# EAGLE design RoboRio Expansion Board V2 (EAGLE 7.5.0)
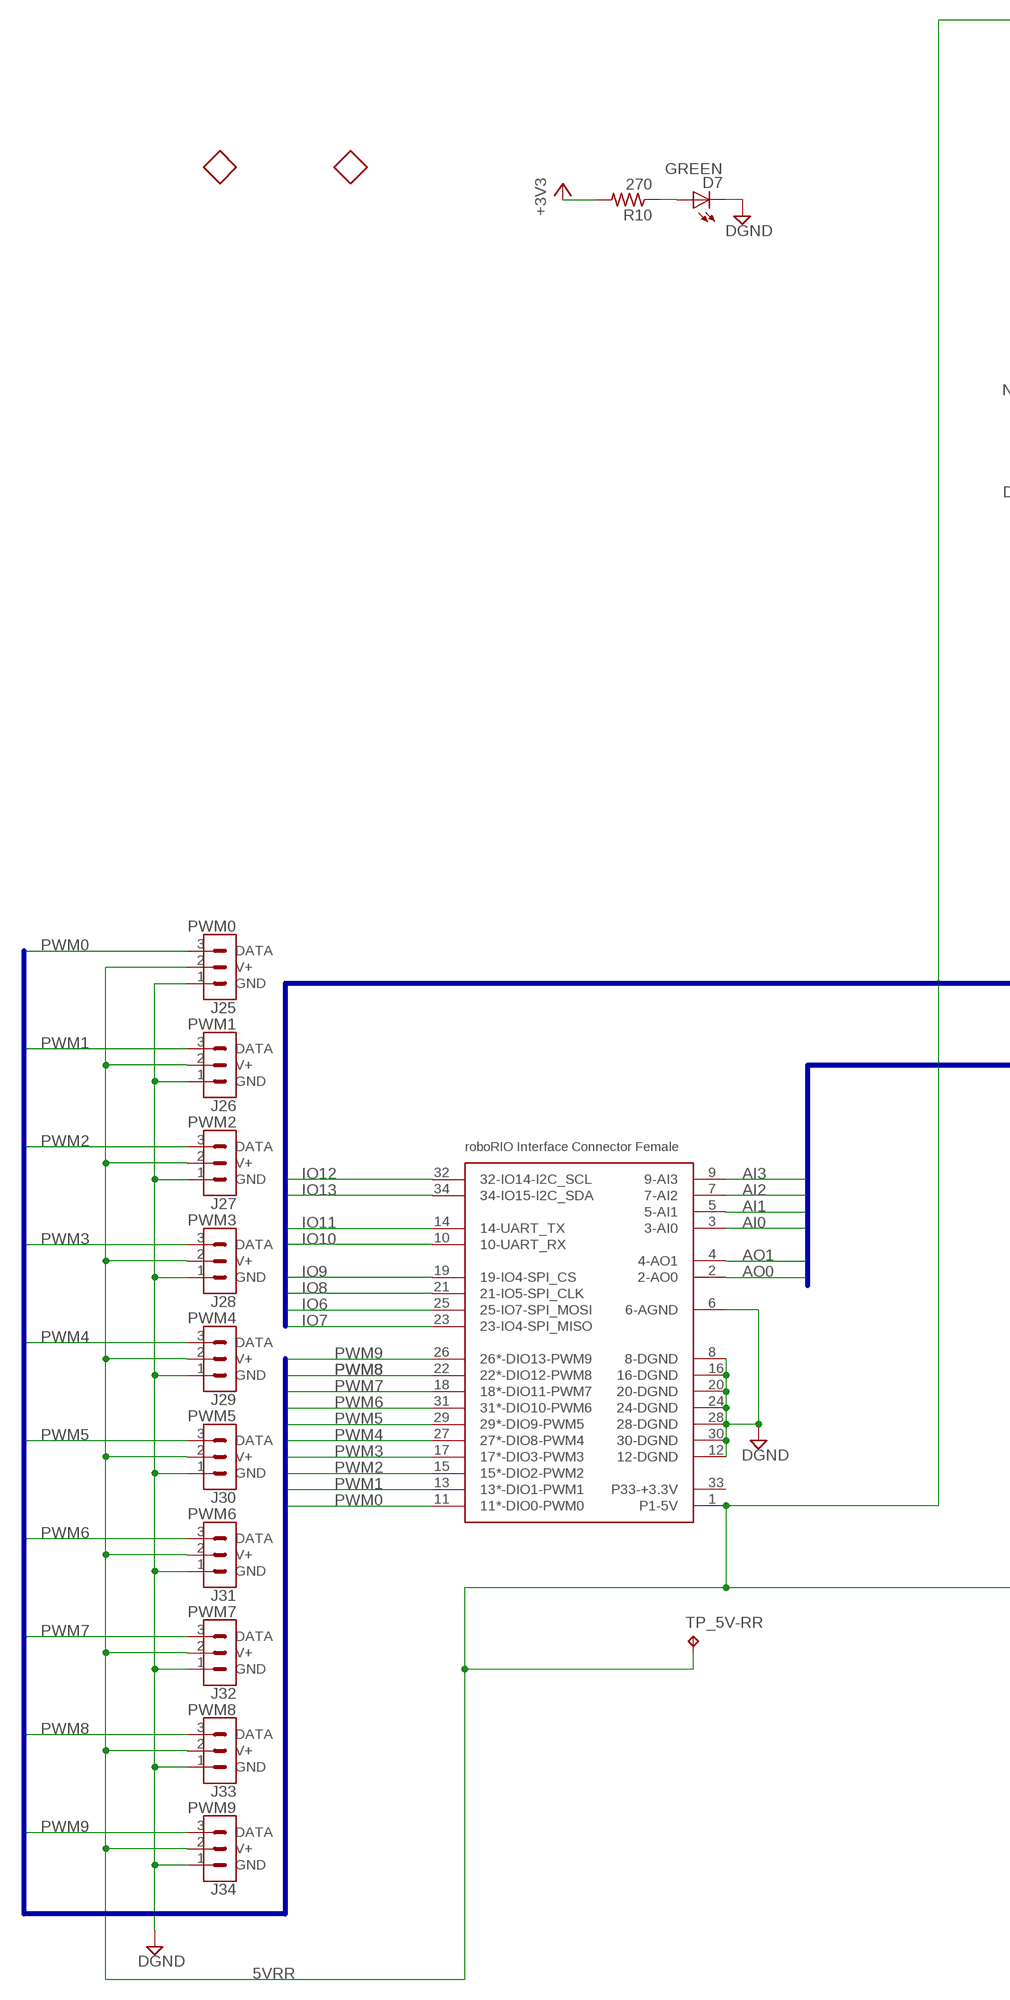
[diagram p0: schematic, sheet 1, part 1 of 3]
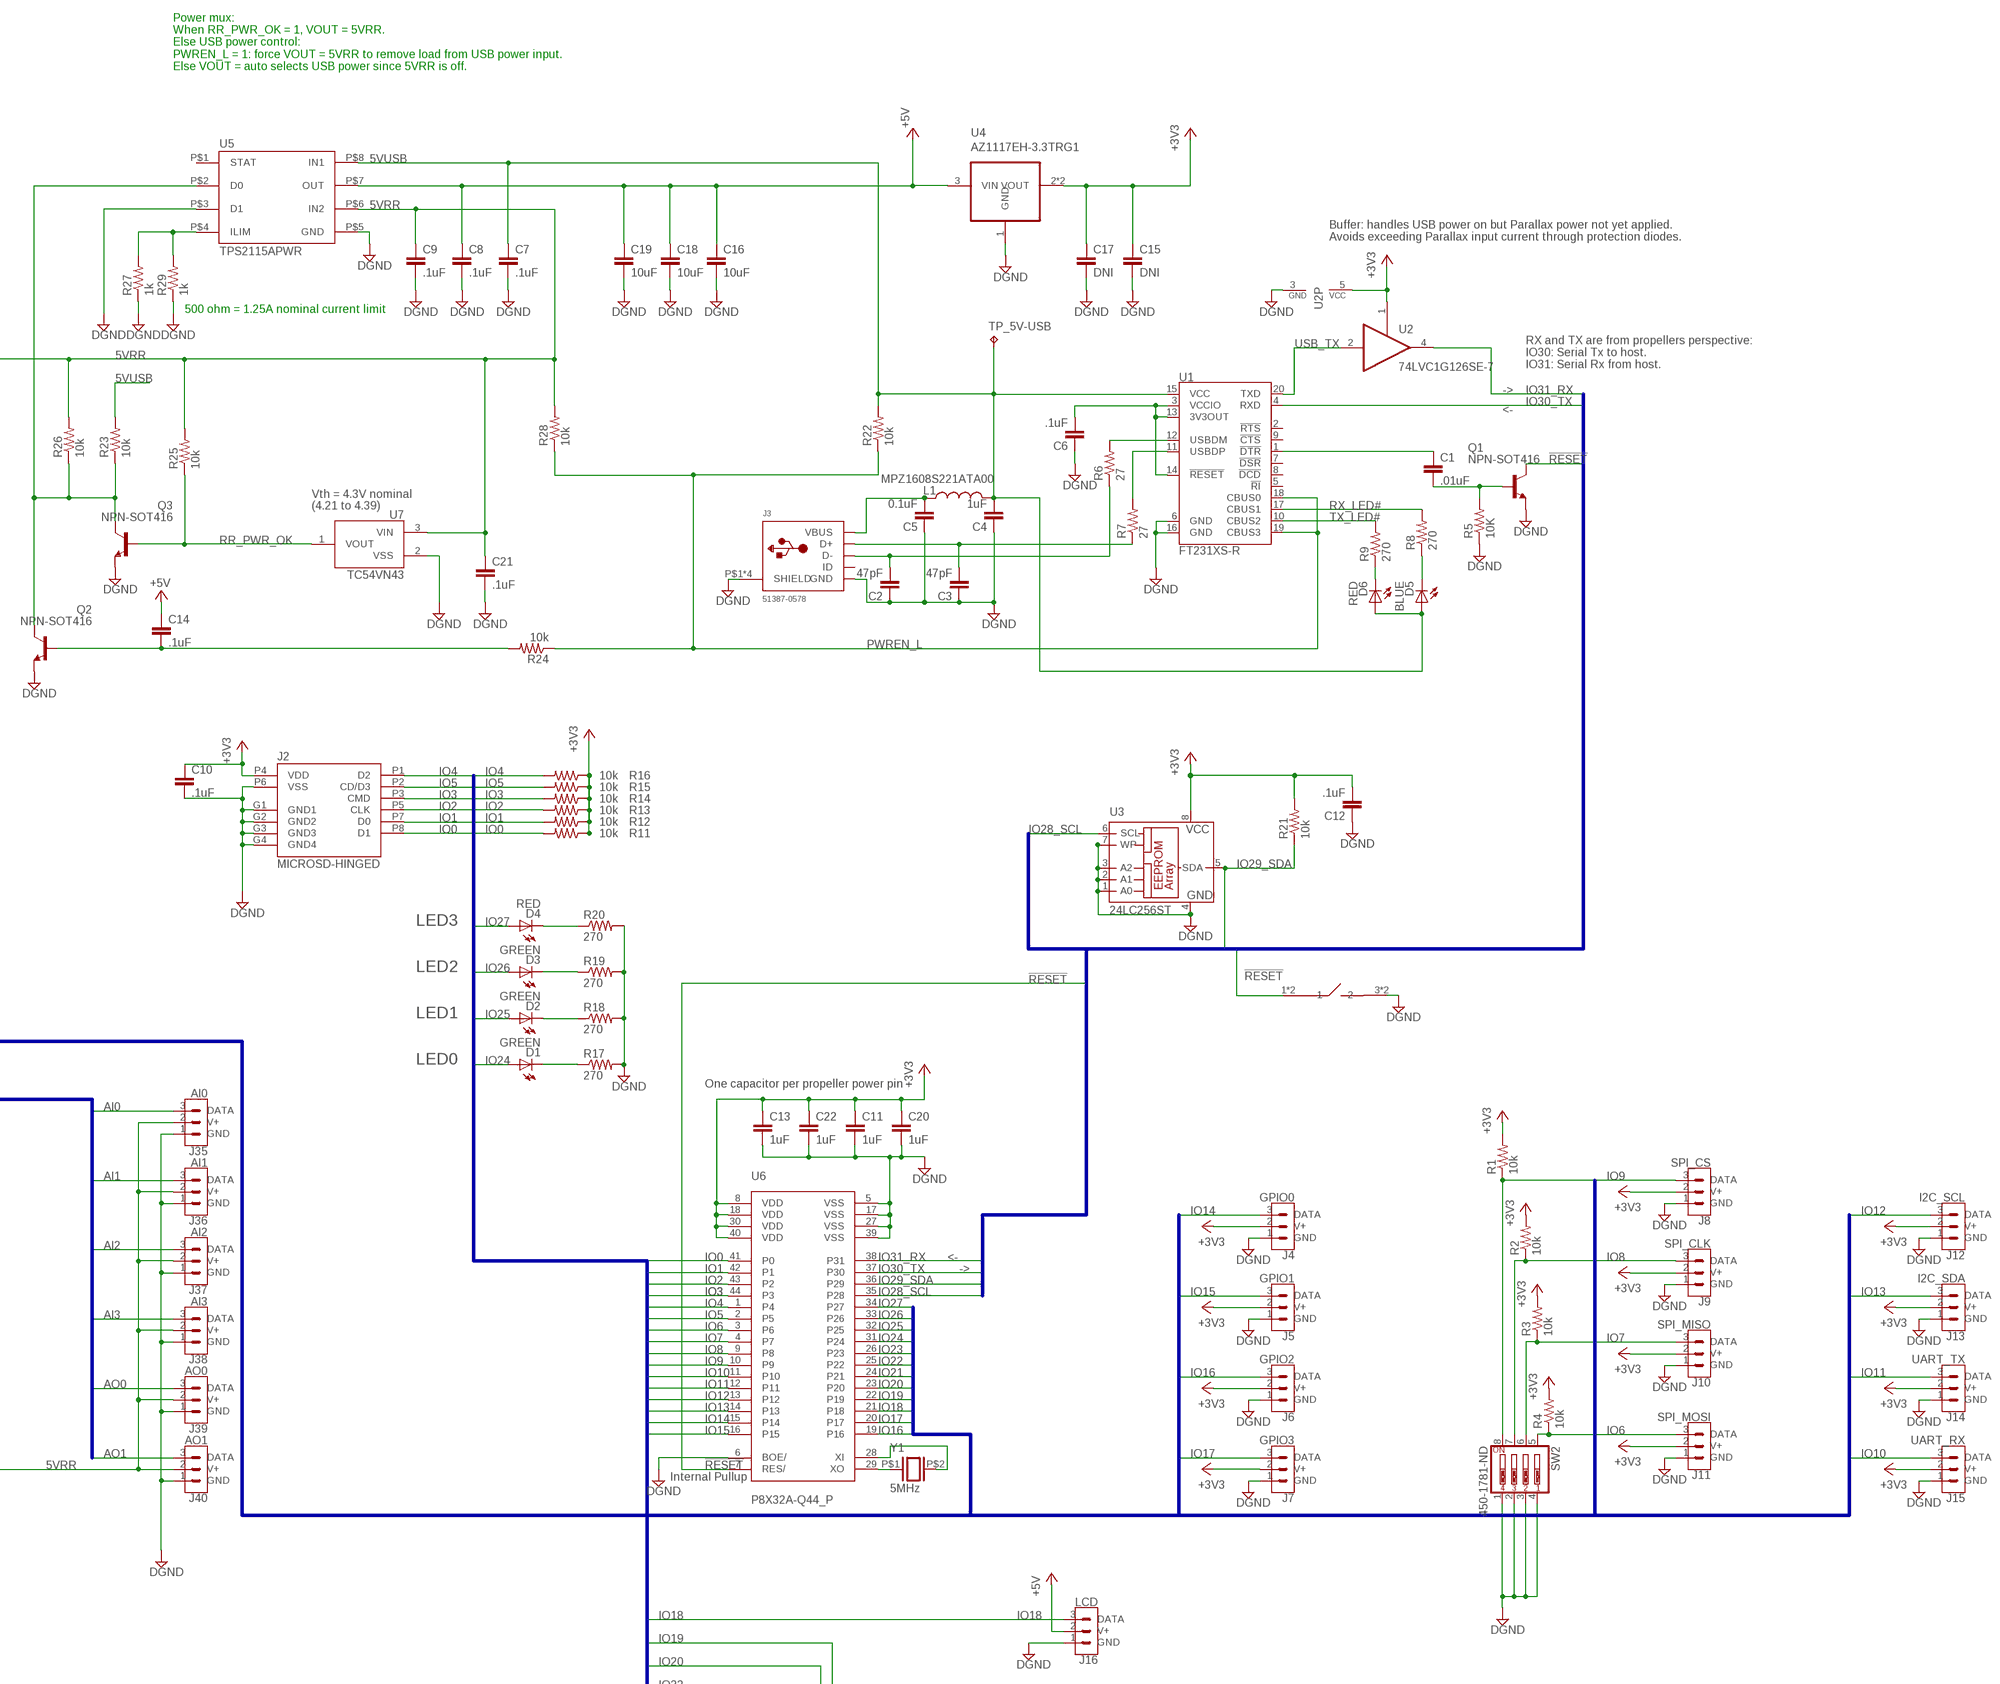
[diagram p1: schematic, sheet 1, part 2 of 3]
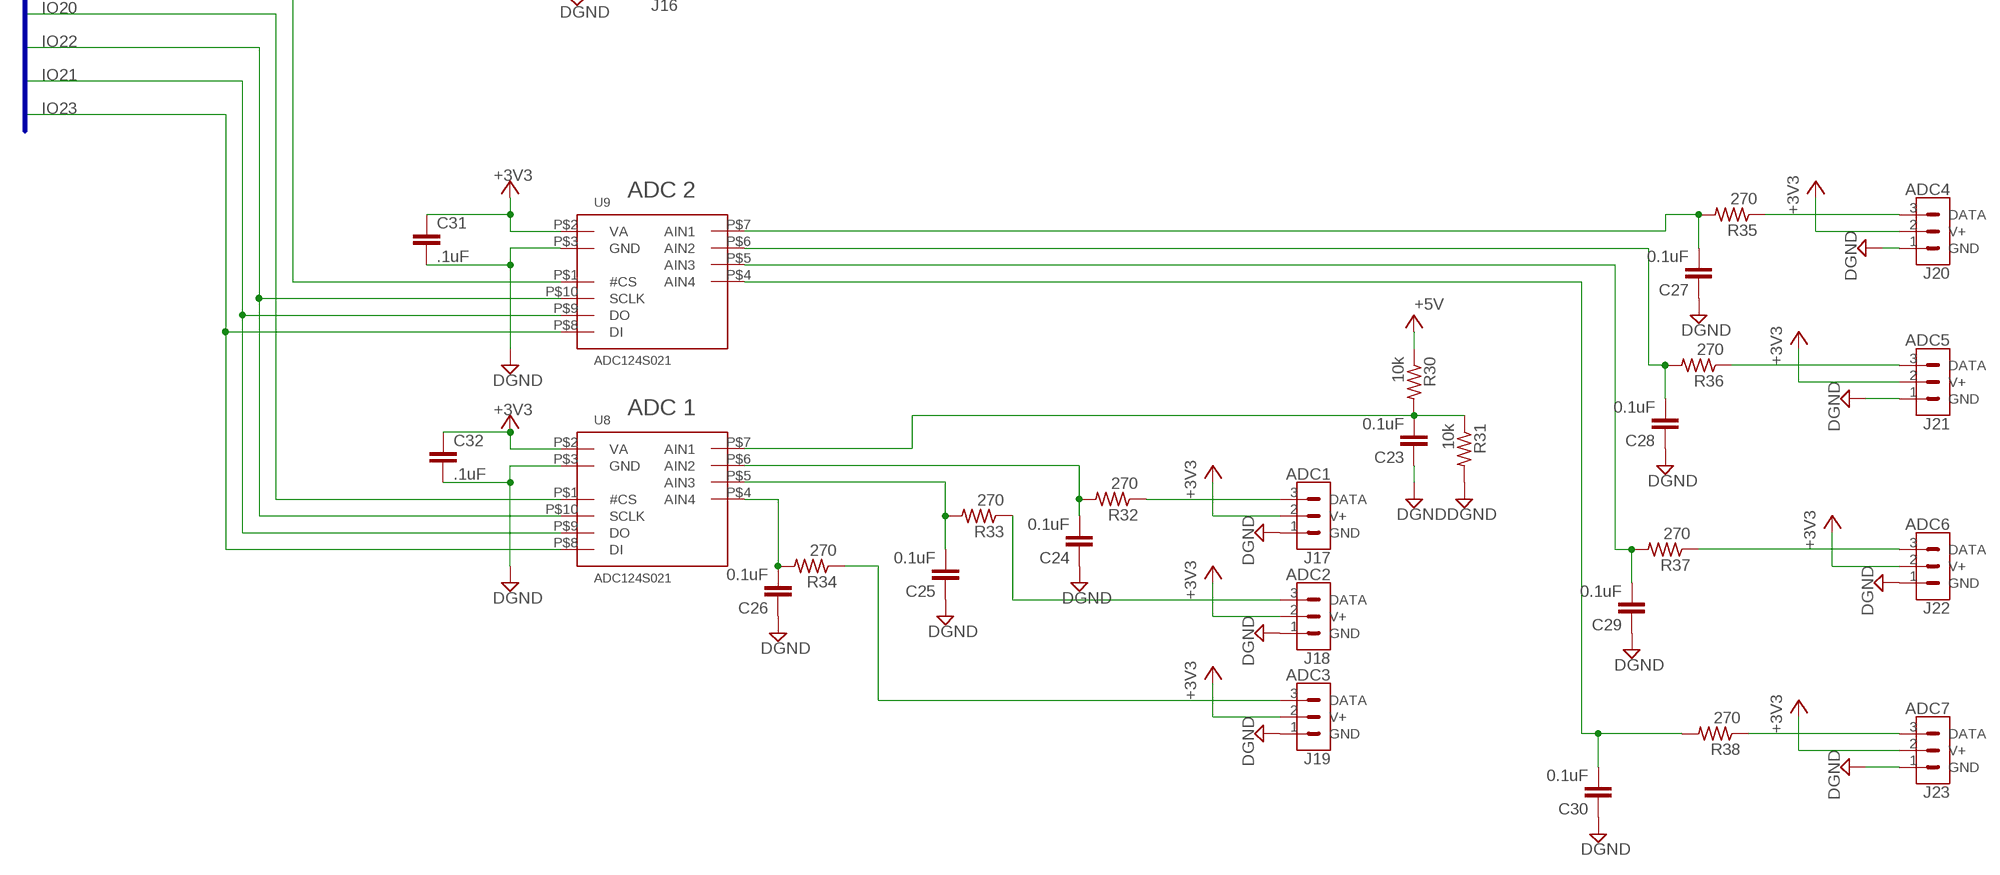
[diagram p2: schematic, sheet 1, part 3 of 3]

## Parts
C1  .01uF  C-EUC0603K  [C0603K]
C2  47pF  C-EUC0603K  [C0603K]
C3  47pF  C-EUC0603K  [C0603K]
C4  1uF  C-EUC0603K  [C0603K]
C5  0.1uF  C-EUC0603K  [C0603K]
C6  .1uF  C-EUC0603K  [C0603K]
C7  .1uF  C-EUC0603K  [C0603K]
C8  .1uF  C-EUC0603K  [C0603K]
C9  .1uF  C-EUC0603K  [C0603K]
C10  .1uF  C-EUC0603K  [C0603K]
C11  1uF  C-EUC0603K  [C0603K]
C12  .1uF  C-EUC0603K  [C0603K]
C13  1uF  C-EUC0603K  [C0603K]
C14  .1uF  C-EUC0603K  [C0603K]
C15  DNI  C-EUC0805K  [C0805K]
C16  10uF  C-EUC0805K  [C0805K]
C17  DNI  C-EUC0805K  [C0805K]
C18  10uF  C-EUC0805K  [C0805K]
C19  10uF  C-EUC0805K  [C0805K]
C20  1uF  C-EUC0603K  [C0603K]
C21  .1uF  C-EUC0603K  [C0603K]
C22  1uF  C-EUC0603K  [C0603K]
C23  0.1uF  C-EUC0603K  [C0603K]
C24  0.1uF  C-EUC0603K  [C0603K]
C25  0.1uF  C-EUC0603K  [C0603K]
C26  0.1uF  C-EUC0603K  [C0603K]
C27  0.1uF  C-EUC0603K  [C0603K]
C28  0.1uF  C-EUC0603K  [C0603K]
C29  0.1uF  C-EUC0603K  [C0603K]
C30  0.1uF  C-EUC0603K  [C0603K]
C31  .1uF  C-EUC0603K  [C0603K]
C32  .1uF  C-EUC0603K  [C0603K]
D1  GREEN  LEDCHIPLED_0603  [CHIPLED_0603]
D2  GREEN  LEDCHIPLED_0603  [CHIPLED_0603]
D3  GREEN  LEDCHIPLED_0603  [CHIPLED_0603]
D4  RED  LEDCHIPLED_0603  [CHIPLED_0603]
D5  BLUE  LEDCHIPLED_0603  [CHIPLED_0603]
D6  RED  LEDCHIPLED_0603  [CHIPLED_0603]
D7  GREEN  LEDCHIPLED_0603  [CHIPLED_0603]
J1  RRINTERFACE-FEMALE  [RRINT-FEMALE]
J2  MICROSD-HINGED  [MICRO_SD_HINGED_TYPE]
J3  51387-0578  USB  [USB-MINIB-0513870578]
J4  GPIO0  3PINDEVICEDEFAULT  [3PINPACKAGE]
J5  GPIO1  3PINDEVICEDEFAULT  [3PINPACKAGE]
J6  GPIO2  3PINDEVICEDEFAULT  [3PINPACKAGE]
J7  GPIO3  3PINDEVICEDEFAULT  [3PINPACKAGE]
J8  SPI_CS  3PINDEVICEDEFAULT  [3PINPACKAGE]
J9  SPI_CLK  3PINDEVICEDEFAULT  [3PINPACKAGE]
J10  SPI_MISO  3PINDEVICEDEFAULT  [3PINPACKAGE]
J11  SPI_MOSI  3PINDEVICEDEFAULT  [3PINPACKAGE]
J12  I2C_SCL  3PINDEVICEDEFAULT  [3PINPACKAGE]
J13  I2C_SDA  3PINDEVICEDEFAULT  [3PINPACKAGE]
J14  UART_TX  3PINDEVICEDEFAULT  [3PINPACKAGE]
J15  UART_RX  3PINDEVICEDEFAULT  [3PINPACKAGE]
J16  LCD  3PINDEVICEDEFAULT  [3PINPACKAGE]
J17  ADC1  3PINDEVICEDEFAULT  [3PINPACKAGE]
J18  ADC2  3PINDEVICEDEFAULT  [3PINPACKAGE]
J19  ADC3  3PINDEVICEDEFAULT  [3PINPACKAGE]
J20  ADC4  3PINDEVICEDEFAULT  [3PINPACKAGE]
J21  ADC5  3PINDEVICEDEFAULT  [3PINPACKAGE]
J22  ADC6  3PINDEVICEDEFAULT  [3PINPACKAGE]
J23  ADC7  3PINDEVICEDEFAULT  [3PINPACKAGE]
J25  PWM0  3PINDEVICEDEFAULT  [3PINPACKAGE]
J26  PWM1  3PINDEVICEDEFAULT  [3PINPACKAGE]
J27  PWM2  3PINDEVICEDEFAULT  [3PINPACKAGE]
J28  PWM3  3PINDEVICEDEFAULT  [3PINPACKAGE]
J29  PWM4  3PINDEVICEDEFAULT  [3PINPACKAGE]
J30  PWM5  3PINDEVICEDEFAULT  [3PINPACKAGE]
J31  PWM6  3PINDEVICEDEFAULT  [3PINPACKAGE]
J32  PWM7  3PINDEVICEDEFAULT  [3PINPACKAGE]
J33  PWM8  3PINDEVICEDEFAULT  [3PINPACKAGE]
J34  PWM9  3PINDEVICEDEFAULT  [3PINPACKAGE]
J35  AI0  3PINDEVICEDEFAULT  [3PINPACKAGE]
J36  AI1  3PINDEVICEDEFAULT  [3PINPACKAGE]
J37  AI2  3PINDEVICEDEFAULT  [3PINPACKAGE]
J38  AI3  3PINDEVICEDEFAULT  [3PINPACKAGE]
J39  AO0  3PINDEVICEDEFAULT  [3PINPACKAGE]
J40  AO1  3PINDEVICEDEFAULT  [3PINPACKAGE]
L1  MPZ1608S221ATA00  INDUCTOR0603  [0603]
Q1  NPN-SOT416  [SC75_INFINEON]
Q2  NPN-SOT416  [SC75_INFINEON]
Q3  NPN-SOT416  [SC75_INFINEON]
R1  10k  R-US_R0603  [R0603]
R2  10k  R-US_R0603  [R0603]
R3  10k  R-US_R0603  [R0603]
R4  10k  R-US_R0603  [R0603]
R5  10K  R-US_R0603  [R0603]
R6  27  R-US_R0603  [R0603]
R7  27  R-US_R0603  [R0603]
R8  270  R-US_R0603  [R0603]
R9  270  R-US_R0603  [R0603]
R10  270  R-US_R0603  [R0603]
R11  10k  R-US_R0603  [R0603]
R12  10k  R-US_R0603  [R0603]
R13  10k  R-US_R0603  [R0603]
R14  10k  R-US_R0603  [R0603]
R15  10k  R-US_R0603  [R0603]
R16  10k  R-US_R0603  [R0603]
R17  270  R-US_R0603  [R0603]
R18  270  R-US_R0603  [R0603]
R19  270  R-US_R0603  [R0603]
R20  270  R-US_R0603  [R0603]
R21  10k  R-US_R0603  [R0603]
R22  10k  R-US_R0603  [R0603]
R23  10k  R-US_R0603  [R0603]
R24  10k  R-US_R0603  [R0603]
R25  10k  R-US_R0603  [R0603]
R26  10k  R-US_R0603  [R0603]
R27  1k  R-US_R0603  [R0603]
R28  10k  R-US_R0603  [R0603]
R29  1k  R-US_R0603  [R0603]
R30  10k  R-US_R0603  [R0603]
R31  10k  R-US_R0603  [R0603]
R32  270  R-US_R0603  [R0603]
R33  270  R-US_R0603  [R0603]
R34  270  R-US_R0603  [R0603]
R35  270  R-US_R0603  [R0603]
R36  270  R-US_R0603  [R0603]
R37  270  R-US_R0603  [R0603]
R38  270  R-US_R0603  [R0603]
SW1  RESETBUTTON9001DEFAULT  [RESETBUTTON9001]
SW2  450-1781-ND  SW_DIP-4  [EDG-04]
TP_5V-RR  TPPAD1-17  [P1-17]
TP_5V-USB  TPPAD1-17  [P1-17]
U1  FT231XS-R  FT231XS  [SSOP20_L]
U2  74LVC1G126SE-7  74LVC1G126DCK  [SC70-5]
U3  24LC256ST  24AA64ST  [TSSOP8]
U4  AZ1117EH-3.3TRG1  REG1117  [SOT223]
U5  TPS2115APWR  [TSSOP-8]
U6  P8X32A-Q44_P  [P8X32A-Q44]
U7  TC54VN43  TC54-CB  [SOT23]
U8  ADC124S021  ADC124S01  [ADC124S021VSSOP]
U9  ADC124S021  ADC124S01  [ADC124S021VSSOP]
U$1  FIDUCIAL_DIAMOND  [FIDUCIAL_40MIL_DIAMOND]
U$2  FIDUCIAL_DIAMOND  [FIDUCIAL_40MIL_DIAMOND]
Y1  5MHz  HC\49USCRYSTAL  [HC\49US]

## Nets
5VRR: C9.1 C21.1 J1.1(P1-5V) J25.2(V+) J26.2(V+) J27.2(V+) J28.2(V+) J29.2(V+) J30.2(V+) J31.2(V+) J32.2(V+) J33.2(V+) J34.2(V+) J35.2(V+) J36.2(V+) J37.2(V+) J38.2(V+) J39.2(V+) J40.2(V+) R25.2 R26.2 R28.2 TP_5V-RR.TP U5.P$6(IN2) U7.3(VIN)
5VUSB: C4.2 C7.1 D5.A D6.A L1.2 R22.2 R23.2 TP_5V-USB.TP U1.15(VCC) U5.P$8(IN1)
!RESET: Q1.3(C) SW1.1 SW1.2 U6.7(RES/)
+3V3: C10.1 C11.1 C12.2 C13.1 C15.1 C17.1 C20.1 C22.1 C31.1 C32.1 J2.P4(VDD) J4.2(V+) J5.2(V+) J6.2(V+) J7.2(V+) J8.2(V+) J9.2(V+) J10.2(V+) J11.2(V+) J12.2(V+) J13.2(V+) J14.2(V+) J15.2(V+) J17.2(V+) J18.2(V+) J19.2(V+) J20.2(V+) J21.2(V+) J22.2(V+) J23.2(V+) R1.2 R2.2 R3.2 R4.2 R10.2 R11.1 R12.1 R13.1 R14.1 R15.1 R16.1 R21.2 U2.1(OE) U2.5(VCC) U3.8(VCC) U4.2(VOUT) U4.4(VOUT) U6.8(VDD) U6.18(VDD) U6.30(VDD) U6.40(VDD) U8.P$2(VA) U9.P$2(VA)
+5V: C8.1 C14.1 C16.1 C18.1 C19.1 J16.2(V+) R30.1 U4.3(VIN) U5.P$7(OUT)
AI0: J1.3(3-AI0) J35.3(DATA)
AI1: J1.5(5-AI1) J36.3(DATA)
AI2: J1.7(7-AI2) J37.3(DATA)
AI3: J1.9(9-AI3) J38.3(DATA)
AO0: J1.2(2-AO0) J39.3(DATA)
AO1: J1.4(4-AO1) J40.3(DATA)
DGND: C2.1 C3.1 C4.1 C5.1 C6.1 C7.2 C8.2 C9.2 C10.2 C11.2 C12.1 C13.2 C15.2 C16.2 C17.2 C18.2 C19.2 C20.2 C21.2 C22.2 C23.1 C24.1 C25.1 C26.1 C27.1 C28.1 C29.1 C30.1 C31.2 C32.2 D7.C J1.6(6-AGND) J1.8(8-DGND) J1.12(12-DGND) J1.16(16-DGND) J1.20(20-DGND) J1.24(24-DGND) J1.28(28-DGND) J1.30(30-DGND) J2.G1(GND1) J2.G2(GND2) J2.G3(GND3) J2.G4(GND4) J2.P6(VSS) J3.GND J3.P$1(SHIELD) J3.P$2(SHIELD) J3.P$3(SHIELD) J3.P$4(SHIELD) J4.1(GND) J5.1(GND) J6.1(GND) J7.1(GND) J8.1(GND) J9.1(GND) J10.1(GND) J11.1(GND) J12.1(GND) J13.1(GND) J14.1(GND) J15.1(GND) J16.1(GND) J17.1(GND) J18.1(GND) J19.1(GND) J20.1(GND) J21.1(GND) J22.1(GND) J23.1(GND) J25.1(GND) J26.1(GND) J27.1(GND) J28.1(GND) J29.1(GND) J30.1(GND) J31.1(GND) J32.1(GND) J33.1(GND) J34.1(GND) J35.1(GND) J36.1(GND) J37.1(GND) J38.1(GND) J39.1(GND) J40.1(GND) Q1.2(E) Q2.2(E) Q3.2(E) R5.1 R17.2 R18.2 R19.2 R20.2 R27.1 R29.1 R31.2 SW1.3 SW1.4 SW2.1 SW2.2 SW2.3 SW2.4 U1.6(GND) U1.16(GND) U2.3(GND) U3.1(A0) U3.2(A1) U3.3(A2) U3.4(GND) U3.7(WP) U4.1(GND) U5.P$3(D1) U5.P$5(GND) U6.5(VSS) U6.6(BOE/) U6.17(VSS) U6.27(VSS) U6.39(VSS) U7.2(VSS) U8.P$3(GND) U9.P$3(GND)
IO0: J2.P8(D1) R11.2 U6.41(P0)
IO1: J2.P7(D0) R12.2 U6.42(P1)
IO2: J2.P5(CLK) R13.2 U6.43(P2)
IO3: J2.P3(CMD) R14.2 U6.44(P3)
IO4: J2.P1(D2) R16.2 U6.1(P4)
IO5: J2.P2(CD/D3) R15.2 U6.2(P5)
IO6: J1.25(25-IO7-SPI_MOSI) J11.3(DATA) R4.1 SW2.5 U6.3(P6)
IO7: J1.23(23-IO4-SPI_MISO) J10.3(DATA) R3.1 SW2.6 U6.4(P7)
IO8: J1.21(21-IO5-SPI_CLK) J9.3(DATA) R2.1 SW2.7 U6.9(P8)
IO9: J1.19(19-IO4-SPI_CS) J8.3(DATA) R1.1 SW2.8 U6.10(P9)
IO10: J1.10(10-UART_RX) J15.3(DATA) U6.11(P10)
IO11: J1.14(14-UART_TX) J14.3(DATA) U6.12(P11)
IO12: J1.32(32-IO14-I2C_SCL) J12.3(DATA) U6.13(P12)
IO13: J1.34(34-IO15-I2C_SDA) J13.3(DATA) U6.14(P13)
IO14: J4.3(DATA) U6.15(P14)
IO15: J5.3(DATA) U6.16(P15)
IO16: J6.3(DATA) U6.19(P16)
IO17: J7.3(DATA) U6.20(P17)
IO18: J16.3(DATA) U6.21(P18)
IO19: U6.22(P19) U9.P$1(#CS)
IO20: U6.23(P20) U8.P$1(#CS)
IO21: U6.24(P21) U8.P$9(DO) U9.P$9(DO)
IO22: U6.25(P22) U8.P$10(SCLK) U9.P$10(SCLK)
IO23: U6.26(P23) U8.P$8(DI) U9.P$8(DI)
IO24: D1.A U6.31(P24)
IO25: D2.A U6.32(P25)
IO26: D3.A U6.33(P26)
IO27: D4.A U6.34(P27)
IO28_SCL: U3.6(SCL) U6.35(P28)
IO29_SDA: R21.1 U3.5(SDA) U6.36(P29)
IO30_TX: U1.4(RXD) U6.37(P30)
IO31_RX: U2.4(O) U6.38(P31)
N$1: C3.2 J3.D+ R7.1
N$2: C2.2 J3.D- R6.1
N$3: C6.2 U1.3(VCCIO) U1.13(3V3OUT) U1.14(!RESET)
N$4: D7.A R10.1
N$5: C14.2 Q2.1(B) R24.2
N$8: J19.3(DATA) R34.1
N$9: J18.3(DATA) R33.1
N$10: C30.2 R38.2 U9.P$4(AIN4)
N$11: R27.2 R29.2 U5.P$4(ILIM)
N$12: D4.C R20.1
N$13: D1.C R17.1
N$14: D2.C R18.1
N$15: C26.2 R34.2 U8.P$4(AIN4)
N$16: C24.2 R32.2 U8.P$6(AIN2)
N$17: D3.C R19.1
N$18: D6.C R9.1
N$19: C1.1 U1.1(!DTR)
N$20: Q2.3(C) Q3.3(C) R23.1 R26.1 U5.P$2(D0)
N$21: C25.2 R33.2 U8.P$5(AIN3)
N$22: J17.3(DATA) R32.1
N$23: D5.C R8.1
N$24: R6.2 U1.12(USBDM)
N$25: C23.2 R30.2 R31.1 U8.P$7(AIN1)
N$26: C1.2 Q1.1(B) R5.2
N$27: R7.2 U1.11(USBDP)
N$28: C5.2 J3.VBUS L1.1
N$30: C29.2 R37.2 U9.P$5(AIN3)
N$32: U6.29(XO) Y1.P$1
N$33: J23.3(DATA) R38.1
N$36: J22.3(DATA) R37.1
N$37: U6.28(XI) Y1.P$2
N$38: C28.2 R36.2 U9.P$6(AIN2)
N$39: J21.3(DATA) R36.1
N$41: C27.2 R35.2 U9.P$7(AIN1)
N$42: J20.3(DATA) R35.1
PWM0: J1.11(11*-DIO0-PWM0) J25.3(DATA)
PWM1: J1.13(13*-DIO1-PWM1) J26.3(DATA)
PWM2: J1.15(15*-DIO2-PWM2) J27.3(DATA)
PWM3: J1.17(17*-DIO3-PWM3) J28.3(DATA)
PWM4: J1.27(27*-DIO8-PWM4) J29.3(DATA)
PWM5: J1.29(29*-DIO9-PWM5) J30.3(DATA)
PWM6: J1.31(31*-DIO10-PWM6) J31.3(DATA)
PWM7: J1.18(18*-DIO11-PWM7) J32.3(DATA)
PWM8: J1.22(22*-DIO12-PWM8) J33.3(DATA)
PWM9: J1.26(26*-DIO13-PWM9) J34.3(DATA)
PWREN_L: R22.1 R24.1 R28.1 U1.18(CBUS0) U1.19(CBUS3)
RR_PWR_OK: Q3.1(B) R25.1 U7.1(VOUT)
RX_LED#: R8.2 U1.17(CBUS1)
TX_LED#: R9.2 U1.10(CBUS2)
USB_TX: U1.20(TXD) U2.2(I)
Unconnected: J1.33(P33-+3.3V) J3.ID U1.2(!RTS) U1.5(!RI) U1.7(!DSR) U1.8(!DCD) U1.9(!CTS) U5.P$1(STAT)

## Buses
IO28_SCL,IO29_SDA,IO30_TX,IO31_RX,!RESET
IO[0..31],UART_TX,UART_RX,I2C_SCL,I2C_SDA
IO[0..31],AI[0..3],AO[0..1],DIO[0..3],DIO[8..13],UART_TX,UART_RX,IO0,I2C_SCL,I2C_SDA
PWM[0..9]

## Notes on the sheet
- Power mux:
  When RR_PWR_OK = 1, VOUT = 5VRR.
  Else USB power control:
  PWREN_L = 1: force VOUT = 5VRR to remove load from USB power input.
  Else VOUT = auto selects USB power since 5VRR is off.
- Buffer: handles USB power on but Parallax power not yet applied.
  Avoids exceeding Parallax input current through protection diodes.
- 500 ohm = 1.25A nominal current limit
- RX and TX are from propellers perspective:
  IO30: Serial Tx to host.
  IO31: Serial Rx from host.
- ->
- <-
- Vth = 4.3V nominal
- (4.21 to 4.39)
- LED3
- LED2
- LED1
- LED0
- One capacitor per propeller power pin
- <-
- ->
- Internal Pullup
- ADC 2
- ADC 1

## Library data of the parts
C1-C32 = resistor:C-EU: CAPACITOR, European symbol
D1-D7 = led:LED: LED OSRAM: - CHIPLED LG R971, LG N971, LY N971, LG Q971, LY Q971, LO R971, LY R971 LH N974, LH R974 LS Q976, LO Q976, LY Q976 LO Q996 - Hyper CHIPLED LW Q18S LB Q993, LB Q99A, LB R99A - SideLED LS A670, LO A670, LY A670, LG A670, LP A670 LB A673, LV A673, LT A673, LW A673 LH A674 LY A675 LS A676, LA A676, LO A676, LY A676, LW A676 LS A679, LY A679, LG A679 - Hyper Micro SIDELED® LS Y876, LA Y876, LO Y876, LY Y876 LT Y87S - SmartLED LW L88C, LW L88S LB L89C, LB L89S, LG L890 LS L89K, LO L89K, LY L89K LS L896, LA L896, LO L896, LY L896 - TOPLED LS T670, LO T670, LY T670, LG T670, LP T670 LSG T670, LSP T670, LSY T670, LOP T670, LYG T670 LG T671, LOG T671, LSG T671 LB T673, LV T673, LT T673, LW T673 LH T674 LS T676, LA T676, LO T676, LY T676, LB T676, LH T676, LSB T676, LW T676 LB T67C, LV T67C, LT T67C, LS T67K, LO T67K, LY T67K, LW E67C LS E67B, LA E67B, LO E67B, LY E67B, LB E67C, LV E67C, LT E67C LW T67C LS T679, LY T679, LG T679 LS T770, LO T770, LY T770, LG T770, LP T770 LB T773, LV T773, LT T773, LW T773 LH T774 LS E675, LA E675, LY E675, LS T675 LS T776, LA T776, LO T776, LY T776, LB T776 LHGB T686 LT T68C, LB T68C - Hyper Mini TOPLED® LB M676 - Mini TOPLED Santana® LG M470 LS M47K, LO M47K, LY M47K Source: http://www.osram.convergy.de LUXEON: - LUMILED® LXK2-PW12-R00, LXK2-PW12-S00, LXK2-PW14-U00, LXK2-PW14-V00 LXK2-PM12-R00, LXK2-PM12-S00, LXK2-PM14-U00 LXK2-PE12-Q00, LXK2-PE12-R00, LXK2-PE12-S00, LXK2-PE14-T00, LXK2-PE14-U00 LXK2-PB12-K00, LXK2-PB12-L00, LXK2-PB12-M00, LXK2-PB14-N00, LXK2-PB14-P00, LXK2-PB14-Q00 LXK2-PR12-L00, LXK2-PR12-M00, LXK2-PR14-Q00, LXK2-PR14-R00 LXK2-PD12-Q00, LXK2-PD12-R00, LXK2-PD12-S00 LXK2-PH12-R00, LXK2-PH12-S00 LXK2-PL12-P00, LXK2-PL12-Q00, LXK2-PL12-R00 Source: www.luxeon.com KINGBRIGHT: KA-3528ASYC Source: www.kingbright.com
J1 = RoboRioConnector:RRINTERFACE-FEMALE
J2 = MicroSdSocket:MICROSD-HINGED
J3 = adafruit:USB: USB Connectors USBMINIB - Surface Mount Female Mini-B USB Connector 4UConnector: 06564 By microbuilder.eu Thru-hole RA Female Mini-B USB Connector 4UConnector: 18732 By ladyada.net
J4-J23 J25-J40 = 3pin:3PINDEVICE
L1 = SparkFun-Passives:INDUCTOR: Inductors Basic Inductor/Choke - 0603 and 1206. Footprints are not proven and vary greatly between part numbers. INDUCTOR POWER 3.3UH 4.0A SMD 0.197" L x 0.197" W x 0.177" H (5.00mm x 5.00mm x 4.50mm)
Q1-Q3 = NPN transistor:NPN-SOT416
R1-R38 = resistor:R-US_: RESISTOR, American symbol
SW1 = resetbutton9001:RESETBUTTON9001
SW2 = crystalsmt:SW_DIP-4: DIP SWITCH
TP_5V-RR TP_5V-USB = testpad:TP: Test pad
U1 = SparkFun-DigitalIC:FT231X: FTDI FT231X Full Speed USB to Full-handshake UART This USB2.0 Full Speed IC offers a compact bridge to full handshake UART interfaces. The device is a UART, capable of operating up to 3MBaud, with low power consumption (8mA). The FT231X includes the complete FT-X series feature set and enables USB to be added into a system design quickly and easily over a UART interface.; PROD_ID: IC-11524; VALUE: FTS31XS-U
U2 = 74xx-little-us:74*1G126: Single Bus Buffer Gate With 3-State Outputs
U3 = microchip:24*: Serial EEPROM I2C; MPN: 25AA640A-I/ST; OC_FARNELL: 1818513; OC_NEWARK: 27M1300
U4 = burr-brown:REG1117: 800mA and 1A Low Dropout (LDO) Positive Regulator 1.8V, 2.5V, 2.85V, 3.3V, 5V, and Adj; MPN: AZ1117EH-3.3TRG1; OC_FARNELL: 1097566; OC_NEWARK: 14P6981
U5 = tps2115apwr:TPS2115APWR
U6 = parallax_propeller:P8X32A-Q44_P
U7 = m-pad-2.1:TC54: Microchip TC54 Voltage Detector Description: The TC54 series are CMOS voltage detectors that are especially well suited for battery-powered applications because of their extremely low 1 uA operating current and small surface-mount packaging. Each part is lasertrimmed to the desired threshold voltage, which can be specified from 1.4V to 7.7V for a 2% tolerance and from 1.5V to 6.0V for a 1% tolerance. The device includes a comparator, low-current highprecision reference, laser-trimmed divider, hysteresis circuit and output driver. The TC54 is available with either an open-drain or complementary output stage. During operation, the TC54's output (VOUT) remains in the logic-high state as long as VIN is greater than the specified threshold voltage (VDET -). When VIN falls below VDET -, the output is driven to a logic-low. VOUT remains low until VIN rises above VDET - by an amount VHYST, whereupon it resets to a logic-high. Features: Precise Detection Thresholds: Standard ±2.0%, Custom ±1.0% Small Packages: 3-Pin SOT-23A, 3-Pin SOT-89, TO-92 and 5-Pin SOT-23A (7.7V only) Low Current Drain: Typ. 1 uA Wide Detection Range: 1.1V to 6.0V and 7.7V Wide Operating Voltage Range: 0.7V to 10V Applications: Battery Voltage Monitoring Microprocessor Reset System Brown-Out Protection Switching Circuit in Battery Backup Level Discriminator Please send any comments to: messi@users.sourceforge.net
U8 U9 = adc124s021cimm:ADC124S01
U$1 U$2 = fiducial:FIDUCIAL_DIAMOND
Y1 = crystalsmt:HC\49USCRYSTAL

## Board
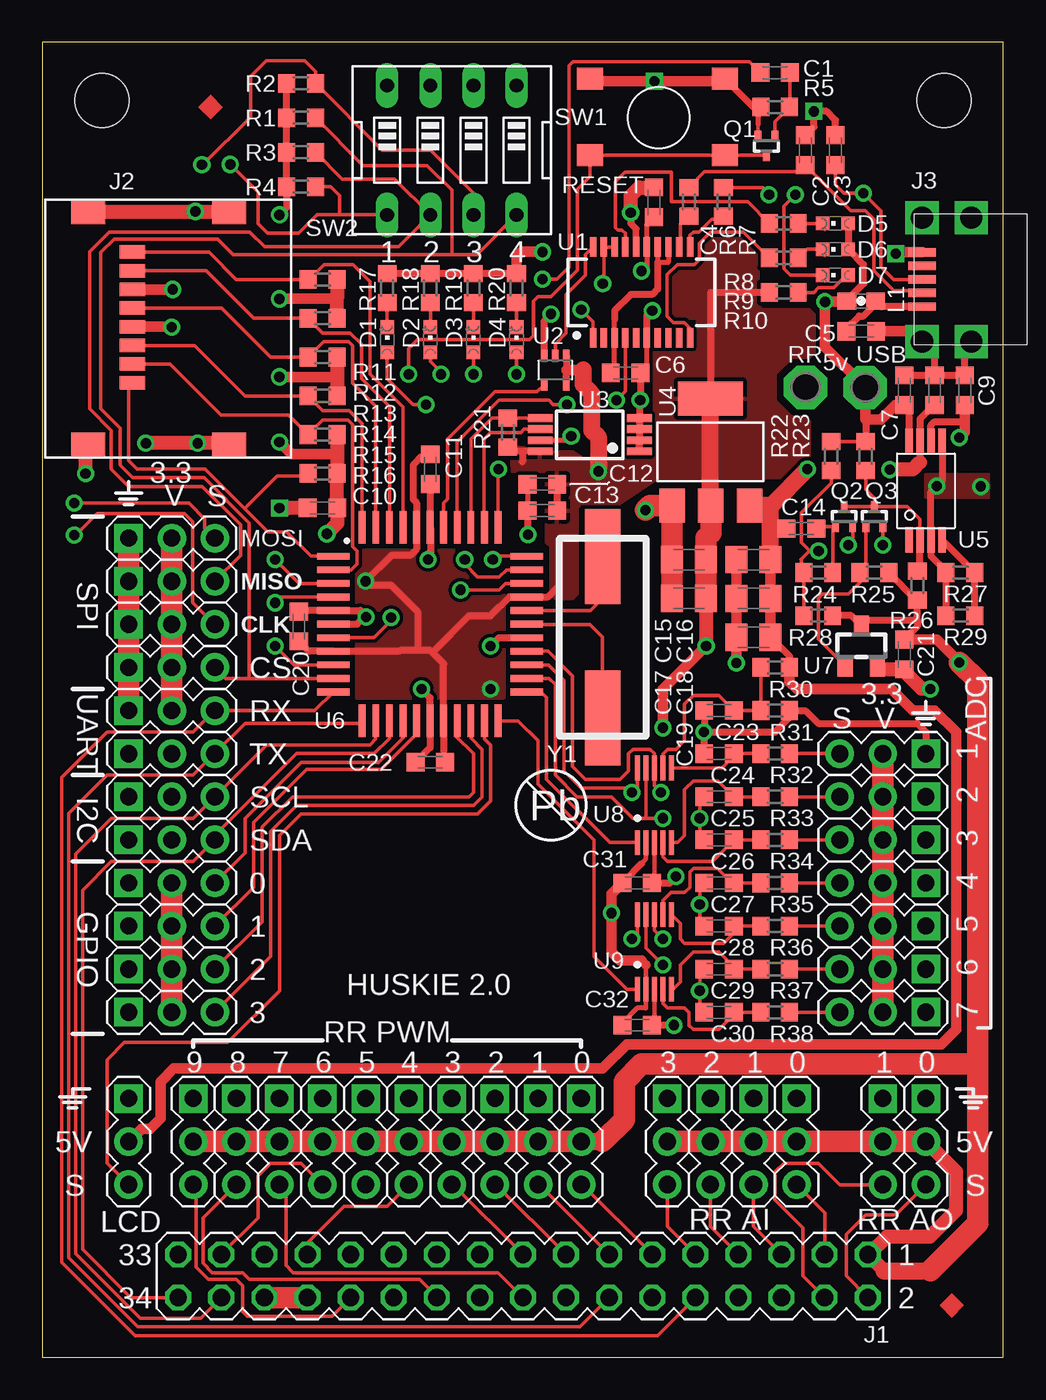
[diagram p3: board, top side]
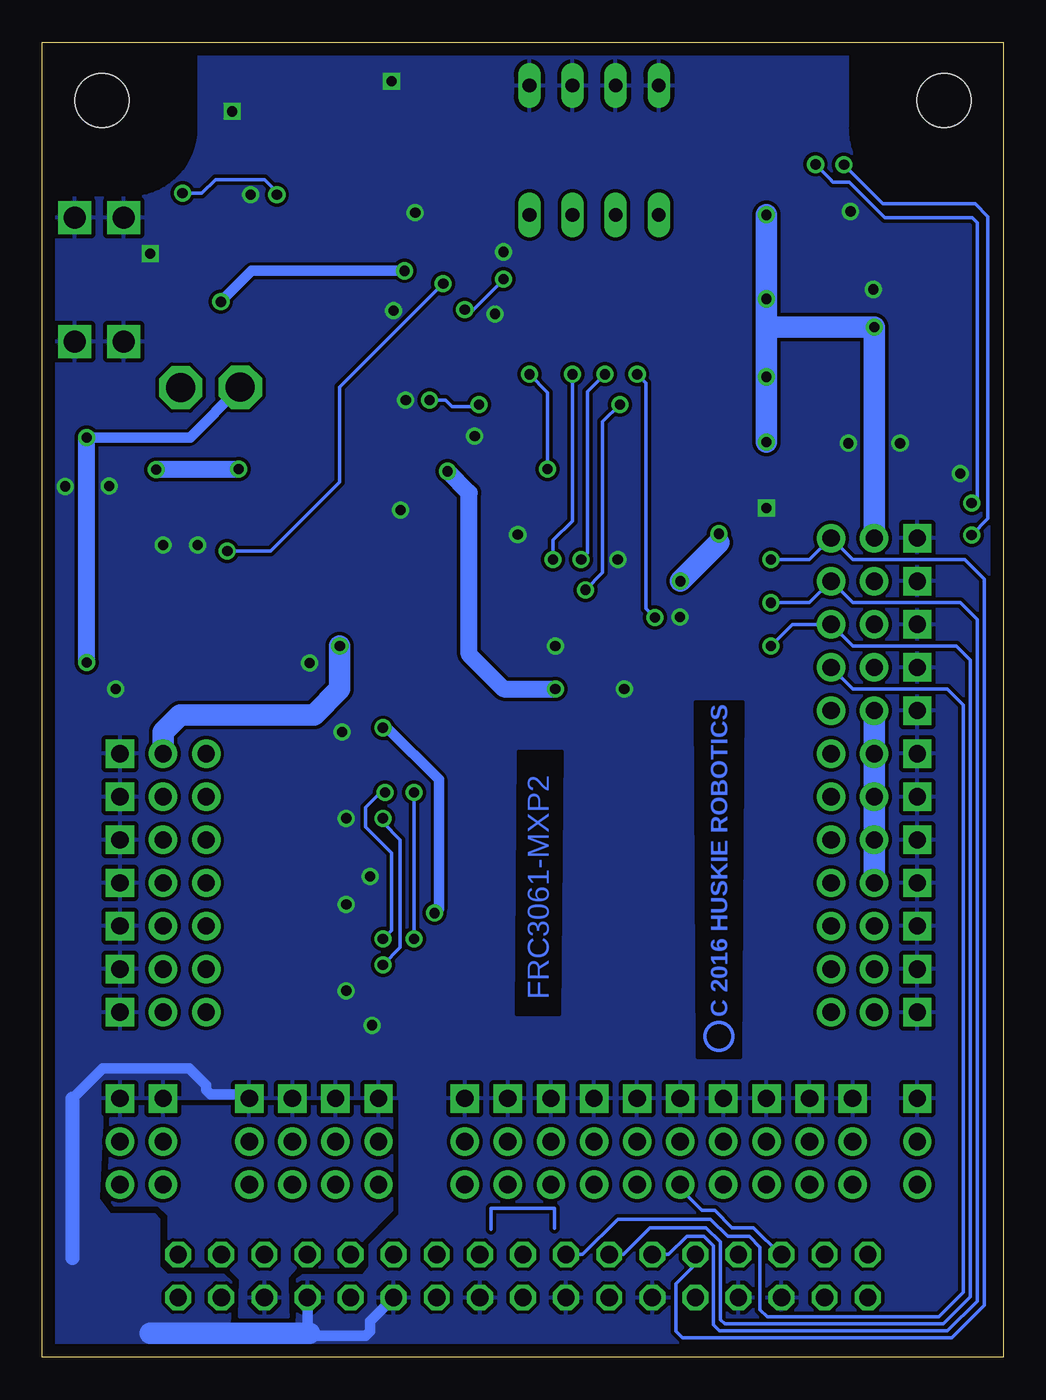
[diagram p4: board, bottom side, seen from below]

Size 56.64 x 77.47 mm. Coordinates in mm from the lower left corner, seen from the top.
Outline: 0,0 56.64,0 56.64,77.47 0,77.47 0,0
Copper layers (1*16): Top 0.035mm / dielectric 1.5mm / Bottom 0.035mm
Design rules "default *": minimum track width 8mil, minimum drill 10mil, track to track 8mil, track to pad 8mil, pad to pad 8mil, via to via 8mil, smd to smd 8mil, copper to edge 30mil, drill to drill 8mil, minimum pad ring 10mil, minimum via ring 8mil, stop-mask expansion 3mil, vias tented up to drill 0mil, thermal gap 10mil

### Footprints (pad centres in the part's own frame; a part is rotated, then mirrored left to right if it is on the bottom)
C0603K = smd 1.05 x 1.08: 1 -0.875,0; 2 0.875,0
C0805K = smd 1.3 x 1.6: 1 -1,0; 2 1,0
CHIPLED_0603 = smd 0.8 x 0.8: A 0,-0.75; C 0,0.75
RRINT-FEMALE = drill 1.016 octagon: 1 8.001,71.425; 2 8.001,73.965; 3 10.541,71.425; 4 10.541,73.965; 5 13.081,71.425; 6 13.081,73.965; 7 15.621,71.425; 8 15.621,73.965; 9 18.161,71.425; 10 18.161,73.965; 11 20.701,71.425; 12 20.701,73.965; 13 23.241,71.425; 14 23.241,73.965; 15 25.781,71.425; 16 25.781,73.965; 17 28.321,71.425; 18 28.321,73.965; 19 30.861,71.425; 20 30.861,73.965; 21 33.401,71.425; 22 33.401,73.965; 23 35.941,71.425; 24 35.941,73.965; 25 38.481,71.425; 26 38.481,73.965; 27 41.021,71.425; 28 41.021,73.965; 29 43.561,71.425; 30 43.561,73.965; 31 46.101,71.425; 32 46.101,73.965; 33 48.641,71.425; 34 48.641,73.965 | hole 3.175: 3.505,3.429; 53.137,3.429
MICRO_SD_HINGED_TYPE = smd 1.45 x 2: G1 6.985,-4.275; G2 6.985,4.025; G3 -6.765,4.025; G4 -6.765,-4.275 | smd 0.8 x 1.5: P1 3.315,-1.675; P2 2.215,-1.675; P3 1.115,-1.675; P4 0.015,-1.675; P5 -1.085,-1.675; P6 -2.185,-1.675; P7 -3.285,-1.675; P8 -4.385,-1.675
USB-MINIB-0513870578 = smd 1.6 x 0.5: D+ 2.9,0; D- 2.9,0.8; GND 2.9,-1.6; ID 2.9,-0.8; VBUS 2.9,1.6 | drill 1.3 square: P$1 2.9,3.65; P$2 0,3.65; P$3 2.9,-3.65; P$4 0,-3.65
3PINPACKAGE = drill 1.016 pad 1.676 square: 1 -2.54,0 | drill 1.016 pad 1.676: 2 0,0; 3 2.54,0
0603 = smd 1.1 x 1: 1 -0.85,0; 2 0.85,0
SC75_INFINEON = smd 0.4 x 0.65: 1 -0.5,-0.575; 2 0.5,-0.575; 3 0,0.575
R0603 = smd 1 x 1.1: 1 -0.85,0; 2 0.85,0
RESETBUTTON9001 = smd 1.55 x 1.3: 1 -3.9,2.2; 2 4.05,2.2; 3 -3.9,-2.3; 4 4.05,-2.3
EDG-04 = drill 0.813 long: 1 -3.81,-3.81; 2 -1.27,-3.81; 3 1.27,-3.81; 4 3.81,-3.81; 5 3.81,3.81; 6 1.27,3.81; 7 -1.27,3.81; 8 -3.81,3.81
P1-17 = drill 1.702 pad 2.54 octagon: TP 0,0
SSOP20_L = smd 0.381 x 1.143: 1 -2.857,-2.68; 2 -2.223,-2.68; 3 -1.587,-2.68; 4 -0.953,-2.68; 5 -0.318,-2.68; 6 0.318,-2.68; 7 0.953,-2.68; 8 1.587,-2.68; 9 2.223,-2.68; 10 2.857,-2.68; 11 2.857,2.68; 12 2.223,2.68; 13 1.587,2.68; 14 0.953,2.68; 15 0.318,2.68; 16 -0.318,2.68; 17 -0.953,2.68; 18 -1.587,2.68; 19 -2.223,2.68; 20 -2.857,2.68
SC70-5 = smd 0.4 x 0.7: 1 -0.65,-0.85; 2 0,-0.85; 3 0.65,-0.85; 4 0.65,0.85; 5 -0.65,0.85
TSSOP8 = smd 0.45 x 1.45: 1 -0.975,-2.925; 2 -0.325,-2.925; 3 0.325,-2.925; 4 0.975,-2.925; 5 0.975,2.925; 6 0.325,2.925; 7 -0.325,2.925; 8 -0.975,2.925
SOT223 = smd 1.499 x 2.007: 1 -2.261,-3.15; 2 0.025,-3.15; 3 2.311,-3.15 | smd 3.81 x 2.007: 4 0,3.15
TSSOP-8 = smd 1.5 x 0.45: P$1 -2.9,1; P$2 -2.9,0.35; P$3 -2.9,-0.3; P$4 -2.9,-0.95; P$5 2.9,-0.95; P$6 2.9,-0.3; P$7 2.9,0.35; P$8 2.9,1
P8X32A-Q44 = smd 1.9 x 0.4: 1 -5.713,4.013; 2 -5.713,3.212; 3 -5.713,2.413; 4 -5.713,1.613; 5 -5.713,0.812; 6 -5.713,0.013; 7 -5.713,-0.787; 8 -5.713,-1.587; 9 -5.713,-2.388; 10 -5.713,-3.188; 11 -5.713,-3.987; 23 5.688,-3.987; 24 5.688,-3.188; 25 5.688,-2.388; 26 5.688,-1.587; 27 5.688,-0.787; 28 5.688,0.013; 29 5.688,0.812; 30 5.688,1.613; 31 5.688,2.413; 32 5.688,3.212; 33 5.688,4.013 | smd 0.4 x 1.9: 12 -4.013,-5.688; 13 -3.212,-5.688; 14 -2.413,-5.688; 15 -1.613,-5.688; 16 -0.812,-5.688; 17 -0.013,-5.688; 18 0.787,-5.688; 19 1.587,-5.688; 20 2.388,-5.688; 21 3.188,-5.688; 22 3.987,-5.688; 34 3.987,5.713; 35 3.188,5.713; 36 2.388,5.713; 37 1.587,5.713; 38 0.787,5.713; 39 -0.013,5.713; 40 -0.812,5.713; 41 -1.613,5.713; 42 -2.413,5.713; 43 -3.212,5.713; 44 -4.013,5.713
SOT23 = smd 0.9 x 1.2: 1 -0.95,-1.2; 2 0.95,-1.2; 3 0,1.2
ADC124S021VSSOP = smd 0.3 x 1.45: P$1 -1,-2.2; P$2 -0.5,-2.2; P$3 0,-2.2; P$4 0.5,-2.2; P$5 1,-2.2; P$6 1,2.2; P$7 0.5,2.2; P$8 0,2.2; P$9 -0.5,2.2; P$10 -1,2.2
HC\49US = smd 5.588 x 2.108: P$1 -4.75,0; P$2 4.75,0

### Placement (x,y rotation side)
C1  43.18,75.69 0 top
C2  44.96,71.12 270 top
C3  46.74,71.12 270 top
C4  36.04,68.05 270 top
C5  48.26,60.45 180 top
C6  34.37,57.99 180 top
C7  50.8,56.97 90 top
C8  52.58,56.97 90 top
C9  54.36,56.97 90 top
C10  16.51,50.04 180 top
C11  22.86,52.32 270 top
C12  29.46,51.44 0 top
C13  29.46,49.89 180 top
C14  44.73,48.82 0 top
C15  10uF  [C0805K]  38.1,46.99 180 top
C16  41.91,46.99 180 top
C17  10uF  [C0805K]  38.1,44.7 180 top
C18  41.91,44.7 180 top
C19  41.91,42.42 180 top
C20  15.11,43.05 90 top
C21  50.8,41.4 270 top
C22  22.86,35.05 180 top
C23  39.88,38.1 0 top
C24  39.88,35.56 0 top
C25  39.88,33.02 0 top
C26  39.88,30.48 0 top
C27  39.88,27.94 0 top
C28  39.88,25.4 0 top
C29  39.88,22.86 0 top
C30  39.88,20.32 0 top
C31  35.05,27.94 0 top
C32  35.05,19.56 0 top
D1  20.32,59.94 0 top
D2  22.86,59.94 0 top
D3  25.4,59.94 0 top
D4  27.94,59.94 0 top
D5  46.74,66.8 90 top
D6  46.74,65.28 90 top
D7  46.74,63.75 90 top
DRILEGEND  [DRILEGEND]  -1.59,-3.91 0 top  (outside the outline)
J1  56.64,77.47 180 top
J2  6.99,60.73 270 top
J3  54.74,63.5 180 top
J4  7.62,27.94 0 top
J5  7.62,25.4 0 top
J6  7.62,22.86 0 top
J7  7.62,20.32 0 top
J8  7.62,40.64 0 top
J9  7.62,43.18 0 top
J10  7.62,45.72 0 top
J11  7.62,48.26 0 top
J12  7.62,33.02 0 top
J13  7.62,30.48 0 top
J14  7.62,35.56 0 top
J15  7.62,38.1 0 top
J16  5.08,12.7 270 top
J17  49.53,35.56 180 top
J18  49.53,33.02 180 top
J19  49.53,30.48 180 top
J20  49.53,27.94 180 top
J21  49.53,25.4 180 top
J22  49.53,22.86 180 top
J23  49.53,20.32 180 top
J25  31.75,12.7 270 top
J26  29.21,12.7 270 top
J27  26.67,12.7 270 top
J28  24.13,12.7 270 top
J29  21.59,12.7 270 top
J30  19.05,12.7 270 top
J31  16.51,12.7 270 top
J32  13.97,12.7 270 top
J33  11.43,12.7 270 top
J34  8.89,12.7 270 top
J35  44.45,12.7 270 top
J36  41.91,12.7 270 top
J37  39.37,12.7 270 top
J38  36.83,12.7 270 top
J39  52.07,12.7 270 top
J40  49.53,12.7 270 top
L1  48.26,62.23 180 top
Q1  42.67,71.37 180 top
Q2  47.24,49.53 0 top
Q3  49.02,49.53 0 top
R1  15.24,73.03 180 top
R2  15.24,75.06 180 top
R3  15.24,70.99 180 top
R4  15.24,68.96 180 top
R5  43.18,73.66 0 top
R6  38.1,68.07 270 top
R7  40.13,68.07 270 top
R8  43.69,66.8 180 top
R9  43.69,64.77 180 top
R10  43.69,62.74 180 top
R11  16.51,63.5 180 top
R12  16.51,61.21 180 top
R13  16.51,58.93 180 top
R14  16.51,56.64 180 top
R15  16.51,54.36 180 top
R16  16.51,52.07 180 top
R17  20.32,62.99 90 top
R18  22.86,62.99 90 top
R19  25.4,62.99 90 top
R20  27.94,62.99 90 top
R21  27.43,54.48 270 top
R22  46.48,53.09 90 top
R23  48.51,53.09 90 top
R24  45.72,46.23 0 top
R25  49.02,46.23 0 top
R26  51.56,45.47 270 top
R27  54.1,46.23 0 top
R28  45.72,43.69 0 top
R29  54.1,43.69 0 top
R30  43.18,40.64 180 top
R31  43.18,38.1 0 top
R32  43.18,35.56 180 top
R33  43.18,33.02 180 top
R34  43.18,30.48 180 top
R35  43.18,27.94 180 top
R36  43.18,25.4 180 top
R37  43.18,22.86 180 top
R38  43.18,20.32 180 top
SW1  36.32,73.03 180 top
SW2  24.13,71.12 180 top
TP_5V-RR  44.98,57.15 0 top
TP_5V-USB  48.49,57.13 0 top
U1  35.31,62.74 0 top
U2  30.23,58.17 180 top
U3  32.26,54.36 90 top
U4  AP1117E33G-13  [SOT223]  39.37,53.34 0 top
U5  52.07,51.05 90 top
U6  22.86,43.18 0 top
U7  48.26,41.91 0 top
U8  36.07,32.51 0 top
U9  36.07,23.88 0 top
U$1  9.91,73.66 0 top
U$2  53.59,3.05 0 top
Y1  33.02,42.42 270 top

### Tracks (layer width: path | path; a pad name or v marks a point on that pad's centre or on a via)
5VRR  (via drill 0.6)
  Top 0.203: 54.04,40.96 v54.04,40.94
  Top 0.406: 51.56,43.43 R26.2 51.48,44.62 R25.2 | 51.56,43.43 48.58,43.43 U7.3 47.68,43.69 R28.2 | 51.56,43.43 51.56,43.04 C21.1 | C9.1 54.36,55.12 52.58,55.12 52.37,54.91 U5.P$6
  Top 0.61: C21.1 52.72,42.28 54.04,40.96 | v54.04,54.19 54.36,54.5 C9.1
  Top 0.813: 49.61,5.08 J1.1 48.72,6.04 49.78,7.11 52.32,7.11 53.85,8.64 53.85,10.92 J39.2
  Top 1.016: 49.61,5.08 52.32,5.08 | J25.2 33.02,12.7 | 54.86,17.27 55.12,17.02
  Top 1.27: J39.2 J40.2 J35.2 J36.2 J37.2 J38.2 | J34.2 J33.2 J32.2 J31.2 J30.2 J29.2 J28.2 J27.2 J26.2 J25.2 | 52.32,5.08 55.12,7.87 55.12,17.02 55.12,39.86 v54.04,40.94 | 33.02,12.7 34.29,13.97 34.29,16.26 35.31,17.27 54.86,17.27
  Bottom 0.61: v54.04,54.19 47.94,54.19 TP_5V-RR.TP
  Bottom 1.016: v54.04,40.94 v54.04,54.19
5VUSB  (via drill 0.6)
  Top 0.203: R22.2 R23.2 | 47.41,62.4 L1.2 47.36,62.18 | 35.62,64.07 35.56,64.01 v35.31,64.01
  Top 0.305: 35.62,64.07 U1.15 35.62,66.75 C4.2
  Top 0.406: U5.P$8 51.07,55.83 C7.1 50.26,56.1 | 48.51,55.24 R23.2 | D5.A D6.A 48.39,64.38 48.39,63.25 47.5,62.36 47.5,62.23 L1.2
  Top 0.61: 50.26,56.1 49.4,55.24 48.51,55.24 48.49,55.27 TP_5V-USB.TP 48.49,57.15 46.12,59.52 v46.12,62.18 47.36,62.18 | L1.2
  Bottom 0.61: v46.12,62.18 44.3,64.01 v35.31,64.01
!RESET  (via drill 0.6)
  Top 0.203: v21.59,57.91 21.59,59.44 22.1,59.94 28.7,59.94 28.96,60.2 28.96,62.23 29.21,62.48 29.97,62.48 31.55,64.06 31.55,68.83 32.28,69.57 32.28,70.81 SW1.2 SW1.1 42.65,70.83 Q1.3 | U6.7 19.53,42.39 20.55,43.41 v20.55,43.59
  Bottom 0.203: v21.59,57.91 21.08,57.4 21.08,44.12 v20.55,43.59
+3V3  (via drill 0.6)
  Top 0.203: R2.2 R1.2 | R13.1 17.36,59.02 | 34.18,28.08 34.28,28.08 34.29,28.07 34.18,27.95 C31.1 | R14.1 17.27,56.73 | 17.36,52.32 R16.1 | C10.1 17.36,50.06 | C11.1 22.75,53.09 22.35,53.09
  Top 0.254: 35.57,23.11 U9.P$2 35.56,21.67 35.56,20.57 | 34.18,19.7 C32.1
  Top 0.279: U8.P$2 35.57,29.34 35.31,29.08
  Top 0.305: 35.56,20.57 35.05,20.57 34.18,19.7
  Top 0.406: R2.2 R3.2 R4.2 14.39,67.73 v13.97,67.31 | 35.31,29.08 34.29,28.07 | C20.1 15.7,41.59 U6.8 21.02,41.59 21.08,41.66 22.1,41.66 | 22.99,41.53 23.65,40.87 U6.18 23.65,35.14 C22.1 | 22.99,41.53 22.86,41.66 22.1,41.66 | C12.2 C13.1 | 22.1,41.66 22.1,43.94 20.57,45.47 19.3,45.47 v19.05,45.72 20.57,47.24 21.69,47.24 22.05,47.6 U6.40 22.05,50.34 21.84,50.55 21.84,52.58 22.35,53.09 | R10.2 39.37,62.74 U4.4 | 22.99,41.53 25.15,43.69 26.42,43.69 27.52,44.79 U6.30 29.81,44.79 30.39,45.38 | 34.04,27.8 C31.1 33.91,27.67 | U4.2 39.37,50.19 | U2.1 30.88,58.17 U2.5 | 31.88,58.17 32,58.17 | 27.68,53.38 R21.2 arc90 27.68,53.38 28.29,53.38 | U3.8 28.29,53.38 | 28.29,53.38 28.29,52.77
  Top 0.559: 35.31,23.37 35.57,23.11
  Top 0.61: v13.97,62.36 17.35,62.36 | C17.1 39.12,44.69 | 17.36,57.76 v13.97,57.76 | R16.1 17.36,49.62 | v39.12,41.91 36.58,39.37 v36.58,37.08 | 33.91,27.67 33.53,27.29 v33.53,26.16 33.53,23.88 34.04,23.37 35.31,23.37 | 30.88,58.17 31.88,58.17 | J2.P4 7.6,60.72 v7.62,60.7 | v13.97,53.92 14.68,53.21 17.36,53.21
  Top 0.813: C15.1 39.12,46.99 | 39.12,48.28 39.4,48.55 | 39.12,44.69 v39.12,41.91 | R13.1 17.36,57.76 R14.1 | R15.1 17.36,53.21 17.36,52.32 | 17.34,62.34 17.35,62.36 | R12.1 17.36,62.34 17.35,62.36 | R11.1 17.36,62.37 17.35,62.36 | 17.36,50.06 R16.1 | v16.76,48.51 17.39,49.13 C10.1
  Top 1.016: 39.37,50.19 U4.4 | v32.77,52.2 32.77,54.23 32.38,54.61 32.38,56.77 31.88,57.28 31.88,58.17
  Top 1.27: C15.1 C17.1 | 39.12,46.99 39.12,48.28 | 39.4,48.55 U4.2 | J4.2 J5.2 J6.2 J7.2 | J11.2 J10.2 J9.2 J8.2 J15.2 | J23.2 J22.2 J21.2 J20.2 J19.2 J18.2 J17.2
  Bottom 0.406: v36.58,37.08 36.32,37.08
  Bottom 0.61: 36.32,37.08 33.27,34.04 33.27,26.42 v33.53,26.16 | 13.96,62.35 v13.97,62.36
  Bottom 0.813: 16.76,48.01 v16.76,48.51
  Bottom 1.016: v26.42,39.37 29.46,39.37 31.5,41.4 31.5,50.93 v32.77,52.2
  Bottom 1.27: v13.97,67.31 v13.97,62.36 13.97,60.7 | 13.97,60.7 v13.97,57.76 v13.97,53.92 | J15.2 J14.2 J12.2 J13.2 J4.2 | J17.2 49.53,36.83 48.51,37.85 40.64,37.85 39.12,39.37 v39.12,41.91 | v19.05,45.72 16.76,48.01 | J11.2 v7.62,60.7 13.97,60.7
  pour Top: 45.21,51.82 36.32,51.82 34.04,50.29 31.75,50.29 31.5,50.04 31.5,44.96 31.24,44.7 30.23,44.7 29.97,44.96 29.97,47.75 29.72,48.01 29.72,52.2 27.69,52.2 27.69,53.34 27.94,53.59 28.45,53.59 28.7,53.34 31.24,53.34 32,52.83 36.07,52.83 36.07,59.18 38.61,59.18 38.61,61.21 37.34,61.21 37.08,61.47 37.11,63.7 37.57,64.11 38.43,64.11 39.01,64.47 39.04,65.48 39.62,66.04 41.05,66.04 42.16,65.02 42.16,61.98 42.42,61.72 45.21,61.72 45.47,61.47 45.47,59.18 45.21,58.93 44.2,58.93 43.18,57.91 43.18,56.39 44.2,55.37 44.96,55.37 45.21,55.12
  pour Top: 27.18,38.86 27.18,47.5 18.54,47.5 18.54,38.86
+5V  (via drill 0.6)
  Top 0.203: C14.1 43.8,48.77
  Top 0.406: C19.1 44.03,41.3 R30.1 | C8.1 52.54,56.1 51.72,55.28 U5.P$7 51.72,52.74 | 43.8,48.77 42.91,48.77
  Top 0.61: C19.1 C18.1 C16.1 | J16.2 5.84,13.46 6.35,13.46 6.96,14.07 6.96,16.23 7.75,17.02 33.02,17.02 34.44,18.44 52.98,18.44 53.85,19.3 53.85,36.83 52.58,38.1 51.31,38.1 50.04,39.37 44.45,39.37 44.03,39.79 R30.1 | 44.2,40.39 44.2,40.64 R30.1 | 43.94,40.64 R30.1
  Top 0.813: 51.72,52.74 51.28,52.3 v49.94,52.3
  Top 1.016: v45.09,52.32 42.95,50.19 | 42.95,50.19 U4.3 42.91,50.19 42.91,48.77 42.91,47.07 42.95,47.03 C16.1 | 42.95,50.19 42.8,50.04 41.66,50.04
  Bottom 0.203: v49.94,52.3 49.91,52.32
  Bottom 1.016: 49.91,52.32 v45.09,52.32
AI0
  Top 0.203: J1.3 46.1,8.51 J35.3
AI1
  Top 0.203: J1.5 41.91,7.7 J36.3
AI2
  Top 0.203: J1.7 39.37,7.7 J37.3
AI3
  Top 0.203: J1.9 36.83,7.7 J38.3
AO0
  Top 0.203: J1.2 47.37,4.78 47.37,7.24 48.51,8.38 50.29,8.38 J39.3
AO1
  Top 0.203: J1.4 44.83,4.78 44.83,7.62 43.18,9.27 43.18,10.92 43.69,11.43 45.72,11.43 46.99,10.16 J40.3
DGND  (via drill 0.6, 0.6 pad 0.81)
  Top 0.203: 44.03,37.68 R31.2 | 38.99,33.01 C25.1 38.73,33.02 v38.73,31.75 38.73,30.48 C26.1 38.99,30.49 | 36.07,19.7 C32.2 35.93,19.93 36.07,20.07 | 36.07,28.08 C31.2 | C11.2 22.85,51.44 | Q2.2 47.75,48.95 47.75,48.26 47.5,48.01 v47.5,47.85 | v49.53,47.85 49.52,47.86 Q3.2 | R5.1 42.17,73.5 | 42.17,72.64 Q1.2 42.17,71.87 | 35.56,59.99 U1.6 | 37.32,28.32 v37.34,28.32 | C27.1 38.73,27.67 v38.73,26.67 38.73,25.67 C28.1 | C29.1 38.73,22.59 v38.73,21.59 38.73,20.59 C30.1 | 52.58,57.91 54.36,57.91 C9.2 | v44.37,68.5 43.69,67.82 43.69,64.14 44.07,63.75 D7.C | 32.38,75.18 32.27,75.3 SW1.4 | 35.62,58.04 35.57,57.99 C6.1 | J2.P6 | v9.02,67.51 9.03,67.5 J2.G3 | 22.86,47.12 v22.73,46.99
  Top 0.279: 36.07,28.08 U8.P$3 | U9.P$3 36.07,20.07
  Top 0.305: 42.17,73.5 42.17,72.64 | 35.62,58.04 U1.6 | C12.1 C13.2 | U3.7 30.92,54.03 v31.17,54.28
  Top 0.381: U1.16 34.99,66.48
  Top 0.406: C9.2 C8.2 C7.2 50.8,57.78 | R29.1 R27.1 53.25,46.32 52.37,47.2 U5.P$3 52.37,50.99 v52.7,51.33 53.02,51.64 U5.P$5 | 49.28,40.78 U7.2 49.39,40.53 | J17.1 52.07,36.83 51.56,37.34 45.72,37.34 44.96,38.1 R31.2 | R20.2 R19.2 R18.2 R17.2 | 39,36.83 43.18,36.83 44.03,37.68 | 22.85,51.44 U6.39 22.86,47.12 | v37.21,19.56 C32.2 | C22.2 arc90 21.83,34.9 C22.2 | U6.6 18.55,43.19 18.97,43.61 v19.07,43.61 19.07,43.66 18.75,43.99 U6.5 15.11,43.99 C20.2 | 32.38,75.18 32.5,75.07 | C3.1 46.74,72.9 46.23,73.41 v45.47,73.41 45.47,72.5 C2.1 | C31.2 36.96,27.94 v37.34,28.32 | C21.2 51.05,40.53 | C6.1 35.24,56.42 | 52.58,57.91 52.58,59.44 52.26,59.44 J3.P$1 | 54.36,57.91 54.36,58.93 54.74,59.31 54.74,59.82 | U3.1 U3.2 U3.3 U3.4 35.18,56.37 35.24,56.42 | C22.2 22.85,35.91 U6.17 22.85,38.85 22.35,39.34 v22.35,39.37 | C13.2 28.59,48.5 v28.63,48.46 | SW1.3 41.89,73.66 R5.1 | v34.67,67.44 34.67,66.8 34.99,66.48 | v35.23,56.39 v35.24,56.4 35.24,56.42 | C23.1 39,36.83 | C24.1 39,36.83 | 39,36.83 v38.99,36.83 | v26.42,41.91 26.9,42.39 U6.27 | U2.3 29.58,61.07 v29.97,61.47 | 2.54,53.6 2.71,53.6 J2.G1 | U1.6 35.62,61.35 v35.94,61.67
  Top 0.61: C16.2 C18.2 C19.2 40.89,42.4 v40.89,40.89 | U4.1 | J3.GND 50.37,65.1 v50.29,65.02 | C5.1 51.05,60.45 51.66,59.85 J3.P$1 | 32.38,75.18 v36.07,75.18 40.08,75.18 SW1.3 | 50.8,40.39 C21.2 | R20.2 27.94,64.82 28.25,65.13 v29.46,65.13 | J2.P6 v7.67,62.92
  Top 0.813: C21.2 49.39,40.53 | v34.67,67.44 34.67,68.43 35.16,68.92 C4.1 | C10.2 v13.97,50.04 | v52.32,39.37 51.82,39.37 50.8,40.39 | J2.G4 J2.G3 | v2.54,52.07 2.54,53.6 | J2.G2 10.91,53.85 v6.1,53.85
  Top 1.27: C17.2 C15.2 U4.1 | J1.30 J1.28 | J15.1 J8.1 J9.1 J10.1 J11.1 | v35.53,49.91 35.81,50.19 U4.1
  Bottom 0.61: 41.02,1.4 40.89,1.4 | 54.86,15.24 53.09,17.02 48.01,17.02 46.99,16 46.99,15.75 46.74,15.49 44.7,15.49 J35.1 | J1.8 41.02,1.4 | 41.02,1.4 40.89,1.27 37.59,1.27 37.34,1.52 37.34,2.11 J1.12
  Bottom 0.813: 50.29,1.4 50.42,1.4 | 54.86,5.84 54.86,15.24
  Bottom 1.27: 40.89,1.4 50.29,1.4
  other vias: 9.14,53.85 55.31,51.31
  pour Bottom (rank 2): 0,77.47 56.64,77.47 56.64,0 42.16,0 42.16,1.78 45.64,1.75 45.54,4.45 45.97,4.83 49.28,4.83 49.78,5.33 49.78,8.13 50.04,8.38 52.65,8.38 53.34,9.32 53.34,9.4 53.09,14.99 52.83,15.24 35.56,15.24 35.56,8.38 37.34,6.6 37.34,5.33 37.74,4.8 41.3,4.8 41.61,4.57 41.63,0 0,0
  pour Bottom: 36.07,14.73 52.58,14.73 52.7,9.4 52.4,8.97 49.81,8.97 49.17,8.36 49.17,5.69 48.79,5.38 45.75,5.38 44.96,4.57 45.01,2.39 42.16,2.36 42.19,2.79 42.21,4.7 41.66,5.33 38.1,5.33 37.85,6.86 36.07,8.64
  pour Top: 52.05,52.01 52.05,50.67 55.71,50.67 55.77,50.67 55.77,51.86 55.77,52.01
IO0
  Top 0.203: U6.41 21.25,55.97 19.3,57.91 19.3,63.37 18.31,64.36 16.61,64.36 15.75,63.5 R11.2 11.43,63.5 9.81,65.12 J2.P8
IO1
  Top 0.203: U6.42 20.45,56.01 18.8,57.66 18.8,59.69 18.14,60.35 16.52,60.35 R12.2 12.45,61.21 9.64,64.02 J2.P7
IO2
  Top 0.203: U6.43 19.65,56.04 18.29,57.4 18.29,59.59 18.03,59.84 16.57,59.84 R13.2 13.46,58.93 10.57,61.82 J2.P5
IO3
  Top 0.203: R14.2 15.66,56.98 | U6.44 18.85,55.02 18.09,55.78 16.52,55.78 R14.2 | R14.2 11.94,56.64 8.96,59.62 J2.P3
IO4
  Top 0.203: 15.49,51.9 R16.2 | 15.49,51.9 15.33,52.07 | U6.1 15.82,47.19 14.4,48.62 13.31,48.62 11.93,50 | 11.93,50 9.6,52.32 5.59,52.32 5.08,52.83 5.08,57.19 J2.P1 | 15.49,51.9 13.83,51.9 11.93,50
IO5
  Top 0.203: U6.2 18.2,46.39 18.54,46.74 18.54,47.5 18.29,47.75 18.29,54.94 18.01,55.22 16.52,55.22 R15.2 14.52,55.5 10.54,55.5 7.52,58.52 J2.P2
IO6  (via drill 0.6)
  Top 0.203: U6.3 15.11,45.59 v13.72,46.99 | SW2.5 17.53,67.31 | 17.53,67.31 16.18,67.31 15.11,66.24 13.26,66.24 12.7,66.8 12.7,68.66 v11.07,70.28 | J11.3 9.58,48.84 9.58,49.38 8.64,50.32 v1.88,50.32 | R4.1 16.99,68.96 17.53,68.43 17.53,67.31
  Bottom 0.203: J1.25 18.16,5.46 19.3,4.32 19.3,1.52 18.92,1.14 3.05,1.14 1.14,3.05 1.14,45.85 2.29,46.99 8.89,46.99 J11.3 11.43,46.99 v13.72,46.99 | v11.07,70.28 10.13,69.34 10.13,69.32 10.06,69.24 9.09,69.24 6.99,67.13 1.83,67.13 1.55,66.85 1.55,50.65 v1.88,50.32
IO7  (via drill 0.6)
  Top 0.203: J10.3 11.68,47.24 11.68,49.05 9.42,51.31 5.08,51.31 4.06,52.32 4.06,54.61 2.79,55.88 2.79,65.15 3.94,66.29 12.22,66.29 13.08,65.43 20.98,65.43 SW2.6 20.75,69.42 17.66,69.42 R3.1 | U6.4 14.06,44.79 v13.72,44.45
  Bottom 0.203: J1.23 19.74,6.04 18.67,7.11 17.65,7.11 17.09,6.55 17.09,1.91 16.74,1.55 3.3,1.55 1.55,3.3 1.55,43.46 2.54,44.45 8.89,44.45 J10.3 11.43,44.45 v13.72,44.45
IO8  (via drill 0.6)
  Top 0.203: U6.9 14.83,40.79 v13.72,41.91 | v9.4,70.26 9.45,70.26 12.27,73.08 12.27,75.49 13.18,76.4 15.44,76.4 16.09,75.76 R2.1 20.03,71.12 22.86,71.12 25.4,68.58 SW2.7 | v1.88,48.44 1.96,48.44 3.23,49.71 8.38,49.71 8.87,49.23 8.87,44.48 J9.3
  Bottom 0.203: J1.21 22.4,6.04 20.83,7.62 17.53,7.62 16.69,6.78 16.69,2.21 16.43,1.96 3.56,1.96 1.96,3.56 1.96,41.07 2.79,41.91 8.89,41.91 J9.3 12.45,43.18 v13.72,41.91 | v9.4,70.26 7.11,67.97 1.68,67.97 0.91,67.21 0.91,49.4 v1.88,48.44
IO9
  Top 0.203: U6.10 12.19,39.99 | 12.19,39.99 10.81,39.99 J8.3 | 24.13,64.97 24.13,68.76 22.68,70.21 18.91,70.21 R1.1 | 24.13,64.97 25.6,64.97 SW2.8 | 24.13,64.97 11.25,64.97 10.34,65.89 4.22,65.89 3.43,65.1 3.43,55.88 4.57,54.74 4.57,52.58 5.33,51.82 9.53,51.82 12.19,49.15 12.19,39.99
  Bottom 0.203: J1.19 24.82,6.04 22.73,8.13 17.27,8.13 16.26,7.11 14.99,7.11 14.35,6.48 14.35,2.79 13.92,2.36 3.81,2.36 2.36,3.81 2.36,38.43 3.3,39.37 8.89,39.37 J8.3
IO10
  Top 0.203: J1.10 36.25,1.27 5.46,1.27 1.14,5.59 | 1.14,5.59 1.14,34.16 | 1.14,34.16 3.81,36.83 8.89,36.83 J15.3 16.05,38.1 U6.11 | 1.14,5.59 1.14,34.16
IO11
  Top 0.203: U6.12 18.69,37.34 11.94,37.34 J14.3 8.89,34.29 3.81,34.29 1.55,32.03 1.55,5.84 5.61,1.78 31.67,1.78 J1.14
IO12
  Top 0.203: J1.32 9.32,2.29 5.77,2.29 1.96,6.1 1.96,29.64 4.06,31.75 8.89,31.75 J12.3 13.21,36.07 19.3,36.07 19.65,36.41 U6.13
IO13
  Top 0.203: U6.14 20.45,36.45 19.56,35.56 14.99,35.56 10.16,30.73 J13.3 8.89,29.21 4.06,29.21 2.36,27.51 2.36,6.35 5.21,3.5 J1.34
IO14
  Top 0.203: U6.15 21.25,36.49 19.81,35.05 15.24,35.05 11.94,31.75 11.94,29.72 J4.3
IO15
  Top 0.203: U6.16 22.05,36.7 19.96,34.62 15.57,34.62 12.45,31.5 12.45,27.69 J5.3
IO16
  Top 0.203: U6.19 24.38,37.43 24.38,36.58 25.4,35.56 25.4,33.27 25.15,33.02 14.73,33.02 12.95,31.24 12.95,25.65 J6.3
IO17
  Top 0.203: U6.20 25.25,36.47 25.91,35.81 25.91,33.02 25.4,32.51 14.99,32.51 13.46,30.99 13.46,23.62 J7.3
IO18
  Top 0.203: U6.21 26.05,36.44 26.42,36.07 26.42,32.77 25.65,32 15.24,32 13.97,30.73 13.97,21.59 10.92,18.54 4.83,18.54 3.81,17.53 3.81,11.43 J16.3
IO19
  Top 0.203: U9.P$1 34.46,21.68 32.51,23.62 32.51,30.48 29.21,33.78 29.21,36.32 28.04,37.49 U6.22
IO20
  Top 0.203: U8.P$1 33.44,30.31 29.72,34.04 29.72,38.86 29.39,39.19 U6.23
IO21  (via drill 0.6)
  Top 0.203: U9.P$9 35.57,24.12 v36.58,23.11 | U6.24 29.86,39.99 30.23,39.62 30.23,34.29 31.5,33.02 33.53,33.02 34.8,31.75 35.56,31.75 35.57,31.75 | 35.57,31.75 v36.58,31.75 | U8.P$9 35.57,31.75
  Bottom 0.203: v36.58,31.75 36.58,31.5 35.56,30.48 35.56,24.13 v36.58,23.11
IO22  (via drill 0.6)
  Top 0.203: U6.25 29.82,40.79 30.73,39.88 30.73,34.54 31.75,33.53 34.49,33.53 v34.75,33.27 35.07,33.59 U8.P$10 | U9.P$10 35.07,24.96 v34.75,24.64
  Bottom 0.203: v34.75,24.64 v34.75,33.27
IO23  (via drill 0.6)
  Top 0.203: v36.45,33.27 36.07,33.66 U8.P$8 36.07,35.56 35.81,35.81 34.8,35.81 34.54,35.56 34.54,34.54 34.04,34.04 32,34.04 31.24,34.8 31.24,40.13 29.78,41.59 U6.26 | U9.P$8 36.07,25.15 v36.58,24.64
  Bottom 0.203: v36.58,24.64 36.07,25.15 36.07,29.72 37.59,31.24 37.59,32.38 36.7,33.27 v36.45,33.27
IO24  (via drill 0.6)
  Top 0.203: D1.A 20.32,57.66 21.84,56.13 v22.61,56.13 | U6.31 27.3,45.59 26.92,45.21 v24.64,45.21
  Bottom 0.203: v22.61,56.13 23.62,55.12 23.62,46.23 v24.64,45.21
IO25  (via drill 0.6)
  Top 0.203: D2.A 22.86,58.67 23.5,58.04 v23.5,57.91 | U6.32 27.34,46.39 26.92,45.97 25.65,45.97 24.89,46.74 v24.89,46.99
  Bottom 0.203: 24.87,46.99 v24.89,46.99 24.51,47.37 24.51,56.9 v23.5,57.91
IO26  (via drill 0.6)
  Top 0.203: D3.A v25.4,57.91 | U6.33 26.75,47.19 v26.54,46.99
  Bottom 0.203: v26.54,46.99 26.54,48.13 25.4,49.28 v25.4,57.91
IO27  (via drill 0.6)
  Top 0.203: D4.A v27.94,57.91 | U6.34 26.85,52.3 v26.87,52.32
  Bottom 0.203: v26.87,52.32 26.87,56.84 v27.94,57.91
IO28_SCL
  Top 0.203: U3.6 28.39,54.68 28.19,54.48 26.42,54.48 26.04,54.1 26.04,48.91 U6.35
IO29_SDA
  Top 0.203: U3.5 R21.1 | R21.1 arc-45 R21.1 | R21.1 26.5,55.33 25.27,54.1 25.27,48.92 U6.36
IO30_TX  (via drill 0.6)
  Top 0.203: U6.37 24.45,53.91 26.92,56.39 29.84,56.39 30.1,56.13 v30.91,56.13 | v33.83,56.39 34.35,56.91 U1.4
  Bottom 0.203: v30.91,56.13 31.04,56.01 32.51,56.01 32.89,56.39 v33.83,56.39
IO31_RX
  Top 0.203: U6.38 23.65,50.32 23.88,50.55 23.88,54.1 26.67,56.9 29.16,56.9 U2.4
N$1  (via drill 0.6)
  Top 0.203: J3.D+ 50.16,63.5 49.4,64.26 49.4,67.56 v48.39,68.58 48.39,68.59 48.37,68.58 47.24,68.58 46.74,69.09 C3.2 | R7.1 42.46,68.92 42.82,68.56 v42.82,68.5
  Bottom 0.203: v48.39,68.58 47.24,68.58 46.43,69.39 43.56,69.39 42.82,68.66 v42.82,68.5
N$2
  Top 0.203: J3.D- 51.7,62.84 50.19,62.84 49,64.03 49,67.06 48.49,67.56 47.64,67.56 C2.2 44.56,69.85 39.03,69.85 R6.1
N$3
  Top 0.203: 33.72,58.17 33.67,58.12
  Top 0.305: 33.72,58.17 U1.3 33.72,61.15 | U1.14 36.26,64.52 36.89,64.52 U1.13
  Top 0.406: 36.26,64.52 36.26,62.93 35.94,62.61 34.67,62.61 33.72,61.66 33.72,61.15 | 33.67,58.12 33.54,57.99 C6.2
N$4
  Top 0.203: 47.24,63.75 D7.A 47.38,63.75 46.63,63.01 45.72,63.01 45.45,62.74 R10.1
N$5
  Top 0.203: 46.49,46.31 R24.2 46.57,48.87 46.48,48.95 | C14.2 45.74,48.95 46.48,48.95 | 46.48,48.95 Q2.1
N$8
  Top 0.203: J19.3 R34.1
N$9
  Top 0.203: R33.1 J18.3
N$10
  Top 0.203: R38.2 C30.2 40.75,20.18 39.88,19.3 38.35,19.3 38.1,19.56 38.1,20.32 37.85,20.57 36.83,20.57 36.58,20.83 36.58,21.67 U9.P$4
N$11
  Top 0.406: R29.2 R27.2 U5.P$4
N$12
  Top 0.203: R20.1 D4.C
N$13
  Top 0.203: D1.C R17.1
N$14
  Top 0.203: R18.1 D2.C
N$15
  Top 0.203: R34.2 C26.2 39.48,29.21 36.83,29.21 36.57,29.47 U8.P$4
N$16
  Top 0.203: R32.2 C24.2 40.75,35.42 40.05,34.71 U8.P$6
N$17
  Top 0.203: D3.C R19.1
N$18
  Top 0.203: R9.1 45.05,65.28 D6.C
N$19  (via drill 0.6)
  Top 0.203: U1.1 32.45,61.02 v31.75,61.72 | C1.1 41.67,76.33 31.27,76.33 31.04,76.1 31.04,64.24 30.33,63.52 v29.46,63.52
  Bottom 0.203: 31.73,61.75 v31.75,61.72 31.24,61.72 29.46,63.5 v29.46,63.52
N$20
  Top 0.203: U5.P$2 51.72,49.37 50.99,50.1 Q3.3 | Q2.3 Q3.3 | R23.1 48.51,51.12 49.02,50.61 Q3.3
  Top 0.406: R26.1 51.72,46.47 U5.P$2
N$21
  Top 0.203: R33.2 C25.2 39.81,33.96 38.35,33.96 37.85,33.45 37.85,30.73 37.42,30.31 U8.P$5
N$22
  Top 0.203: J17.3 R32.1
N$23
  Top 0.203: R8.1 D5.C
N$24
  Top 0.203: U1.12 37.59,65.48 37.59,66.8 38.01,67.22 R6.2
N$25
  Top 0.203: R30.2 R31.1 C23.2 39.86,38.99 38.35,38.99 37.85,38.48 37.85,36.32 37.34,35.81 36.83,35.81 36.57,35.55 U8.P$7
N$26
  Top 0.203: C1.2 44.05,73.69 R5.2 43.17,72.8 Q1.1 43.17,71.89
N$27
  Top 0.203: U1.11 38.16,66.1 38.35,66.29 38.7,66.29 39.46,67.06 39.62,67.06 39.79,67.22 R7.2
N$28
  Top 0.203: 49.47,61.9 49.13,62.23 L1.1 49.13,62.2
  Top 0.406: J3.VBUS 49.47,61.9 | C5.2 47.38,60.59 48.13,61.34 48.39,61.34 49.11,62.06 L1.1
N$29
  cutout Bottom: 26.04,35.69 28.57,35.69 28.7,20.19 26.16,20.19
  cutout Bottom: 15.37,38.61 18.16,38.61 18.03,17.65 15.49,17.65
N$30
  Top 0.203: R37.2 C29.2 40.75,23 39.88,23.88 38.35,23.88 37.59,23.11 37.59,22.1 37.19,21.69 37.08,21.69 U9.P$5
N$31
  Bottom 0.203: 26.47,7.58 26.47,8.76 30.21,8.76 30.21,7.53
N$32
  Top 0.203: U6.29 32.31,43.99 33.02,44.7 Y1.P$1
N$33
  Top 0.203: J23.3 R38.1
N$36
  Top 0.203: R37.1 J22.3
N$37
  Top 0.203: U6.28 32.26,43.18 33.02,42.42 Y1.P$2
N$38
  Top 0.203: R36.2 C28.2 40.75,25 40.13,24.38 37.85,24.38 37.59,24.64 37.59,25.55 U9.P$6 37.08,26.06
N$39
  Top 0.203: J21.3 R36.1
N$41
  Top 0.203: R35.2 C27.2 40.64,27.94 39.78,28.8 38.35,28.8 38.15,28.6 38.15,27.69 37.85,27.38 37.03,27.38 36.58,26.92 U9.P$7
N$42
  Top 0.203: R35.1 J20.3
PWM0
  Top 0.203: J1.11 31.83,10.16 J25.3
PWM1
  Top 0.203: J1.13 29.29,10.16 J26.3
PWM2
  Top 0.203: J1.15 26.75,10.16 J27.3
PWM3
  Top 0.203: J1.17 24.21,10.16 J28.3
PWM4
  Top 0.203: J1.27 15.62,6.73 17.78,8.89 20.32,8.89 J29.3
PWM5
  Bottom 0.203: J1.29 13.16,6.04 14.73,7.62 16,7.62 17.02,8.64 17.78,8.64 19.05,9.91 J30.3
PWM6
  Top 0.203: J1.31 12.7,8.2 12.7,10.67 13.46,11.43 15.24,11.43 J31.3
PWM7
  Top 0.203: J32.3 14.35,9.78 14.35,5.41 14.78,4.98 26.85,4.98 J1.18
PWM8
  Top 0.203: J33.3 9.47,8.2 9.47,5.51 10.01,4.98 11.79,4.98 12.19,4.57 22.23,4.57 23.24,3.56 J1.22
PWM9
  Top 0.203: J1.26 17.07,2.41 12.06,2.41 11.81,2.67 11.81,4.19 11.43,4.57 9.78,4.57 9.07,5.28 9.07,10.16 J34.3
PWREN_L  (via drill 0.6)
  Top 0.203: R28.1 R24.1 44.73,46.23 44.73,46.97 44.7,46.99 45.21,47.5 v45.74,47.5 45.24,47.5 44.73,48.01 44.73,49.76 46.48,51.51 R22.1 | U1.18 U1.19 33.08,63.31 v33.02,63.25
  Bottom 0.203: v33.02,63.25 39.12,57.15 39.12,51.56 43.18,47.5 v45.74,47.5
RR_PWR_OK
  Top 0.203: U7.1 45.72,42.3 45.72,44.7 45.97,44.96 47.5,44.96 48.26,45.72 48.26,46.14 R25.1 48.52,46.58 Q3.1
RX_LED#
  Top 0.203: R8.2 41.57,68.07 37.08,68.07 37.08,69.83 34.34,69.83 33.78,69.27 33.78,66.55 33.91,66.42 34.16,66.42 34.35,66.23 U1.17
TX_LED#
  Top 0.203: R9.2 41.31,66.29 39.37,66.29 38.71,65.63 38.71,64.67 38.43,64.39 37.41,64.39 36.8,63.78 36.8,61.34 37.19,60.96 37.85,60.96 38.16,60.64 U1.10
USB_TX
  Top 0.203: U2.2 30.23,59.69 30.86,60.33 30.86,62.61 32,63.75 32,64.97 U1.20
(copper drawn outside any net)
  shapes: Bottom circle x1

### Text on the board
Bottom: C 2016 HUSKIE ROBOTICS | FRC3061-MXP2
tPlace: RESET | V | S | S | V | Pb | HUSKIE 2.0 | 5V | 5V | S | S
tNames: 1 | 2 | 3 | 4 | R11 / R12 / R13 / R14 / R15 / R16 | RR | USB | 5v | 3.3 | MOSI | MISO | SPI | CLK | CS | RX | 3.3 | UART | TX | 1 | ADC | SCL | 2 | I2C | 3 | SDA | 0 | 4 | 5 | 1 | GPIO | 2 | 6 | 3 | 7 | RR PWM | 9 | 8 | 7 | 6 | 5 | 4 | 3 | 2 | 1 | 0 | 3 | 2 | 1 | 0 | 1 | 0 | RR AI | RR AO
DrillLegend: LAYER-STACK
DrillLegend_01-16: 01-16
DrillLegend_01-20: 01-20
fab_dwg: 1. Material / 1.1. All material to be RoHS compliant. / 1.2. All material to be tolerant of Pb-free solder process temperatures. / 1.3. All material, including solder mask and legends, shall have a / UL flammability rating of 94V-0. / Date code and manufacturers UL symbol/type shall be permanently / marked or etched on the board. / 1.4 2 oz finished copper weight, nominal (1oz plating over 1oz). / 1.5 Finish: ENIG. / / 2. Solder Mask / 2.1. Solder mask both sides, with blue color. / 2.2. Encroach primary side via pads but prevent solder mask in via holes. / 2.3. No solder mask on secondary side via pads. / 2.4. No solder mask on component pads / 2.5. Solder mask must be present between adjacent SMT pads. / / 3. Silkscreen / 3.1. No silkscreen allowed on exposed lands or in holes. / / 4. Dimensions / 4.1. Overall Thickness: .062" +/- 10% / 4.2. Hole tolerance +/- .005"